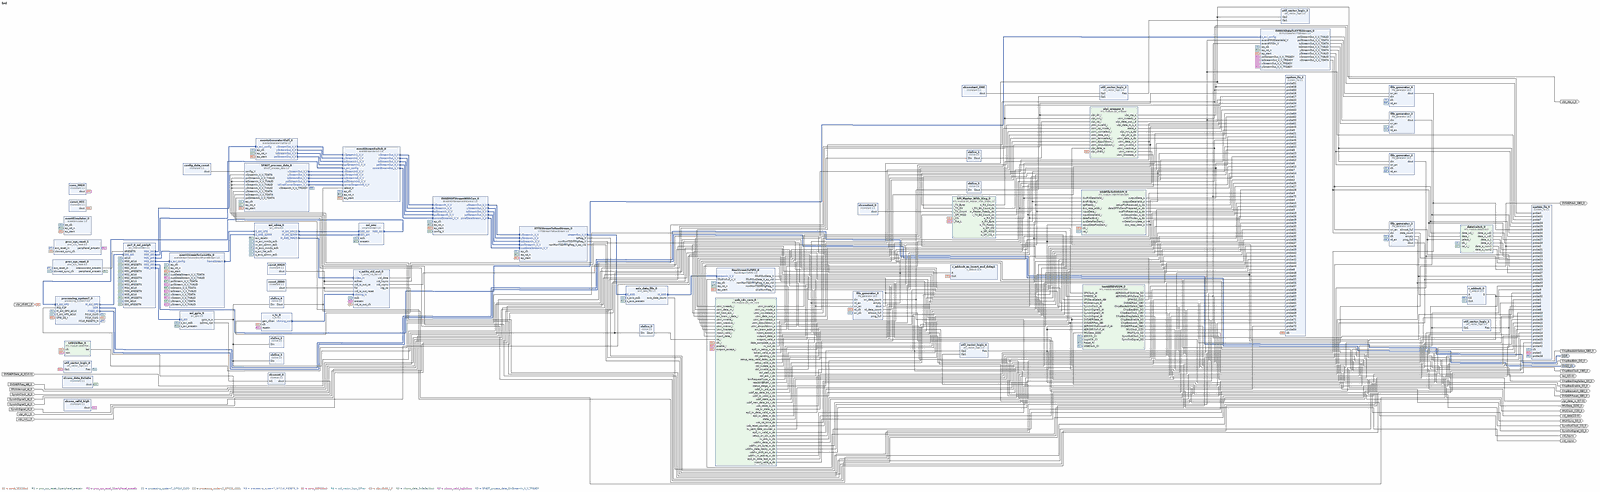
[diagram p0: block diagram of the top level, whole]
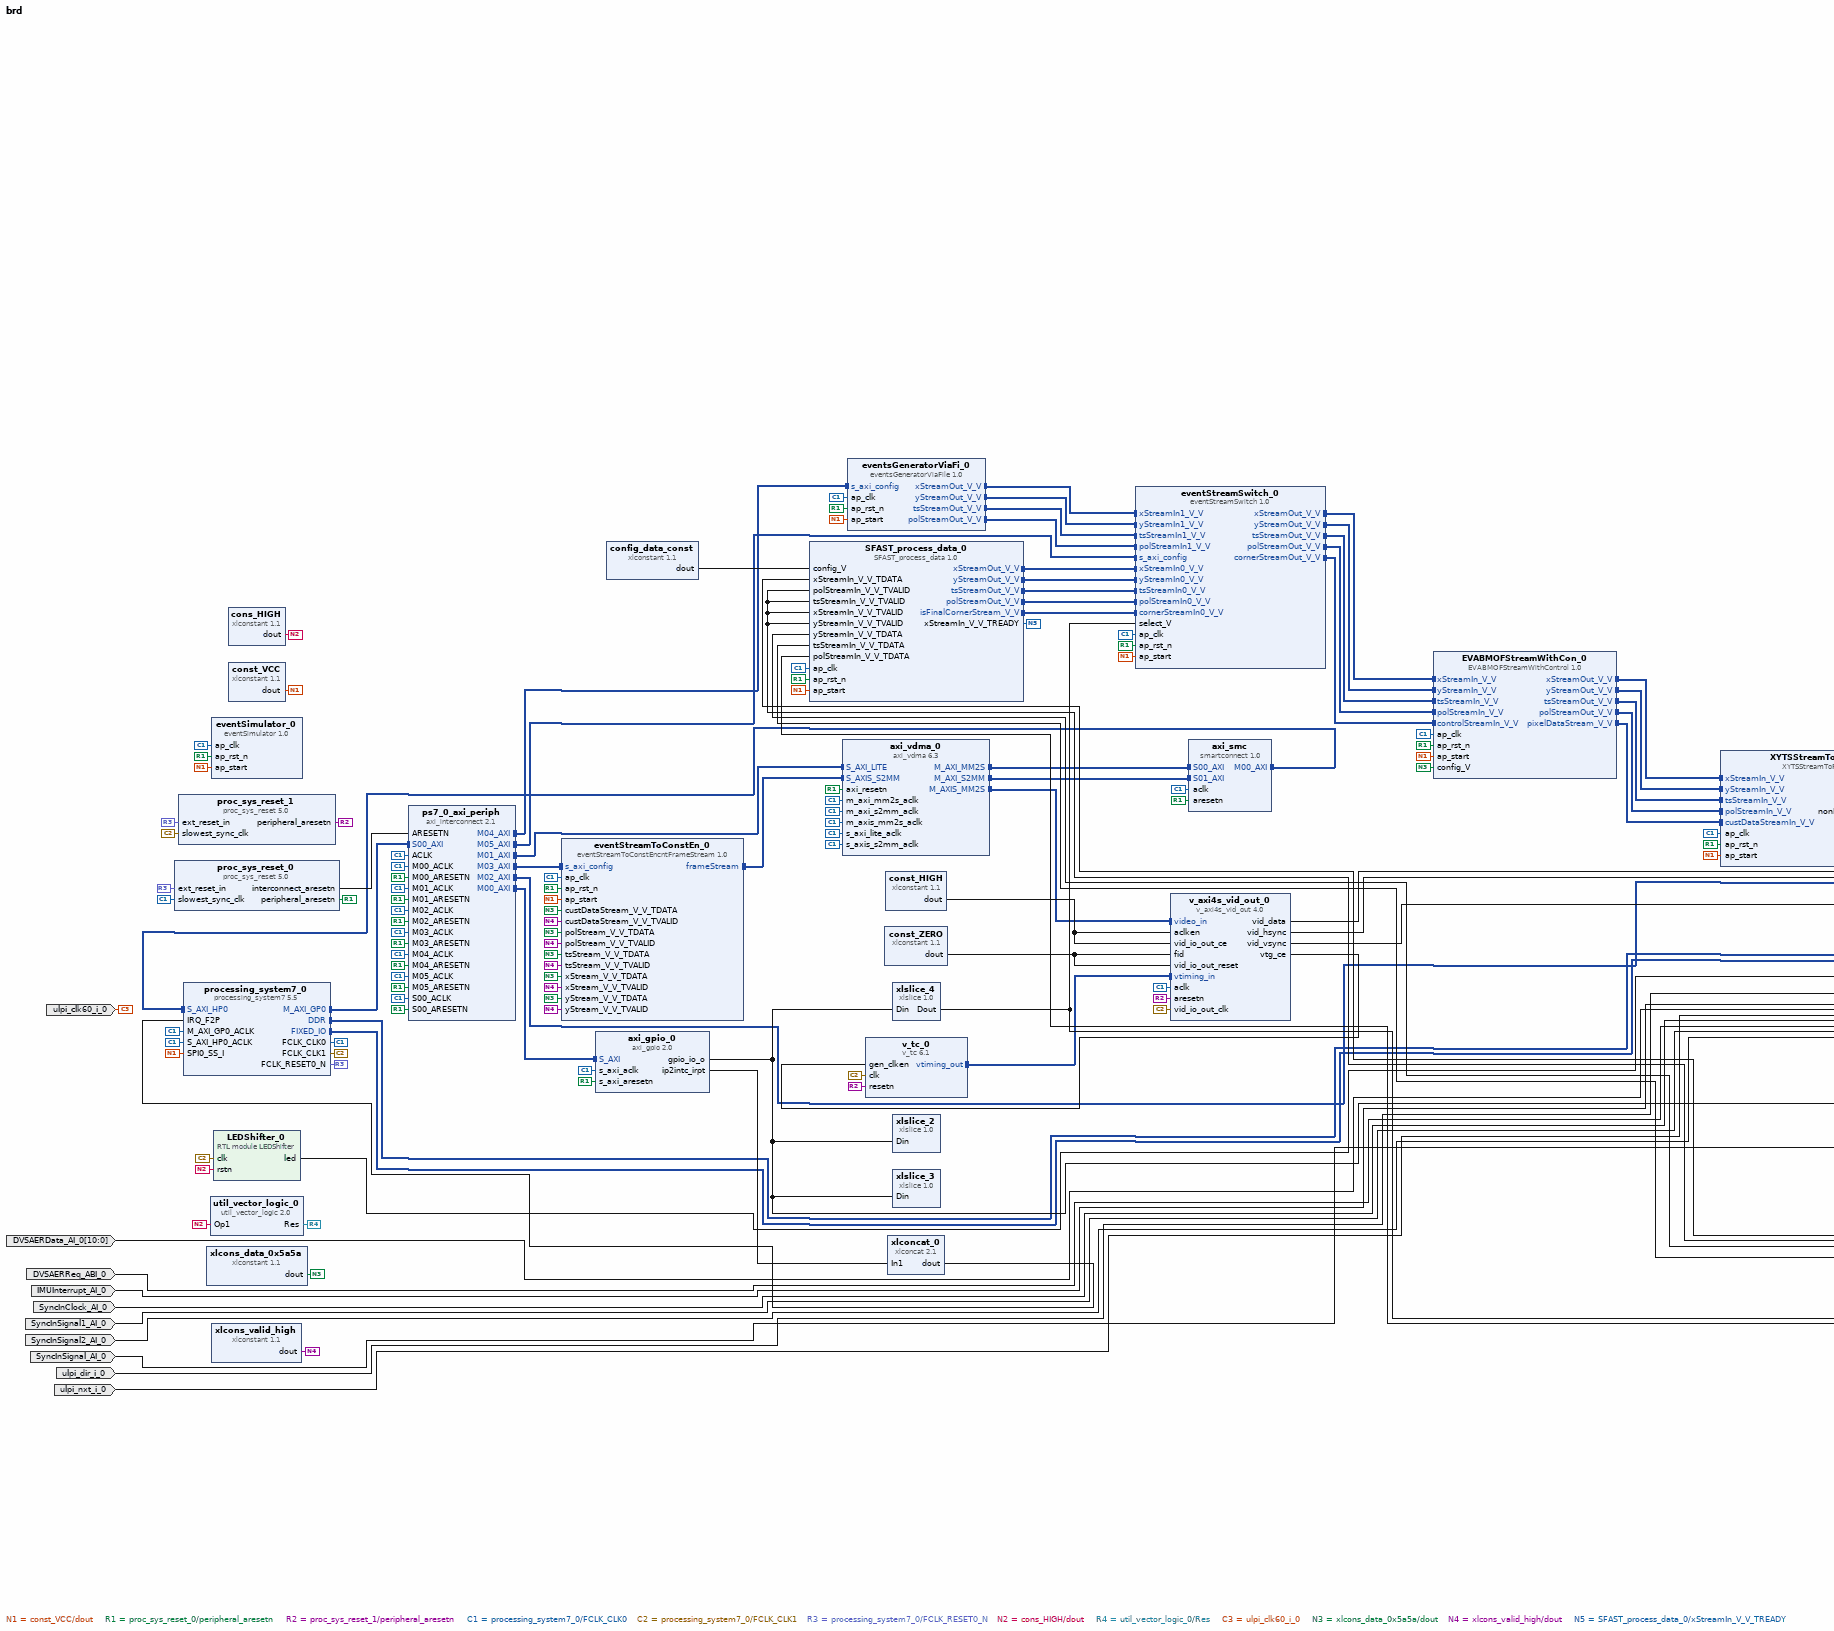
[diagram p1: block diagram of the top level, left part]
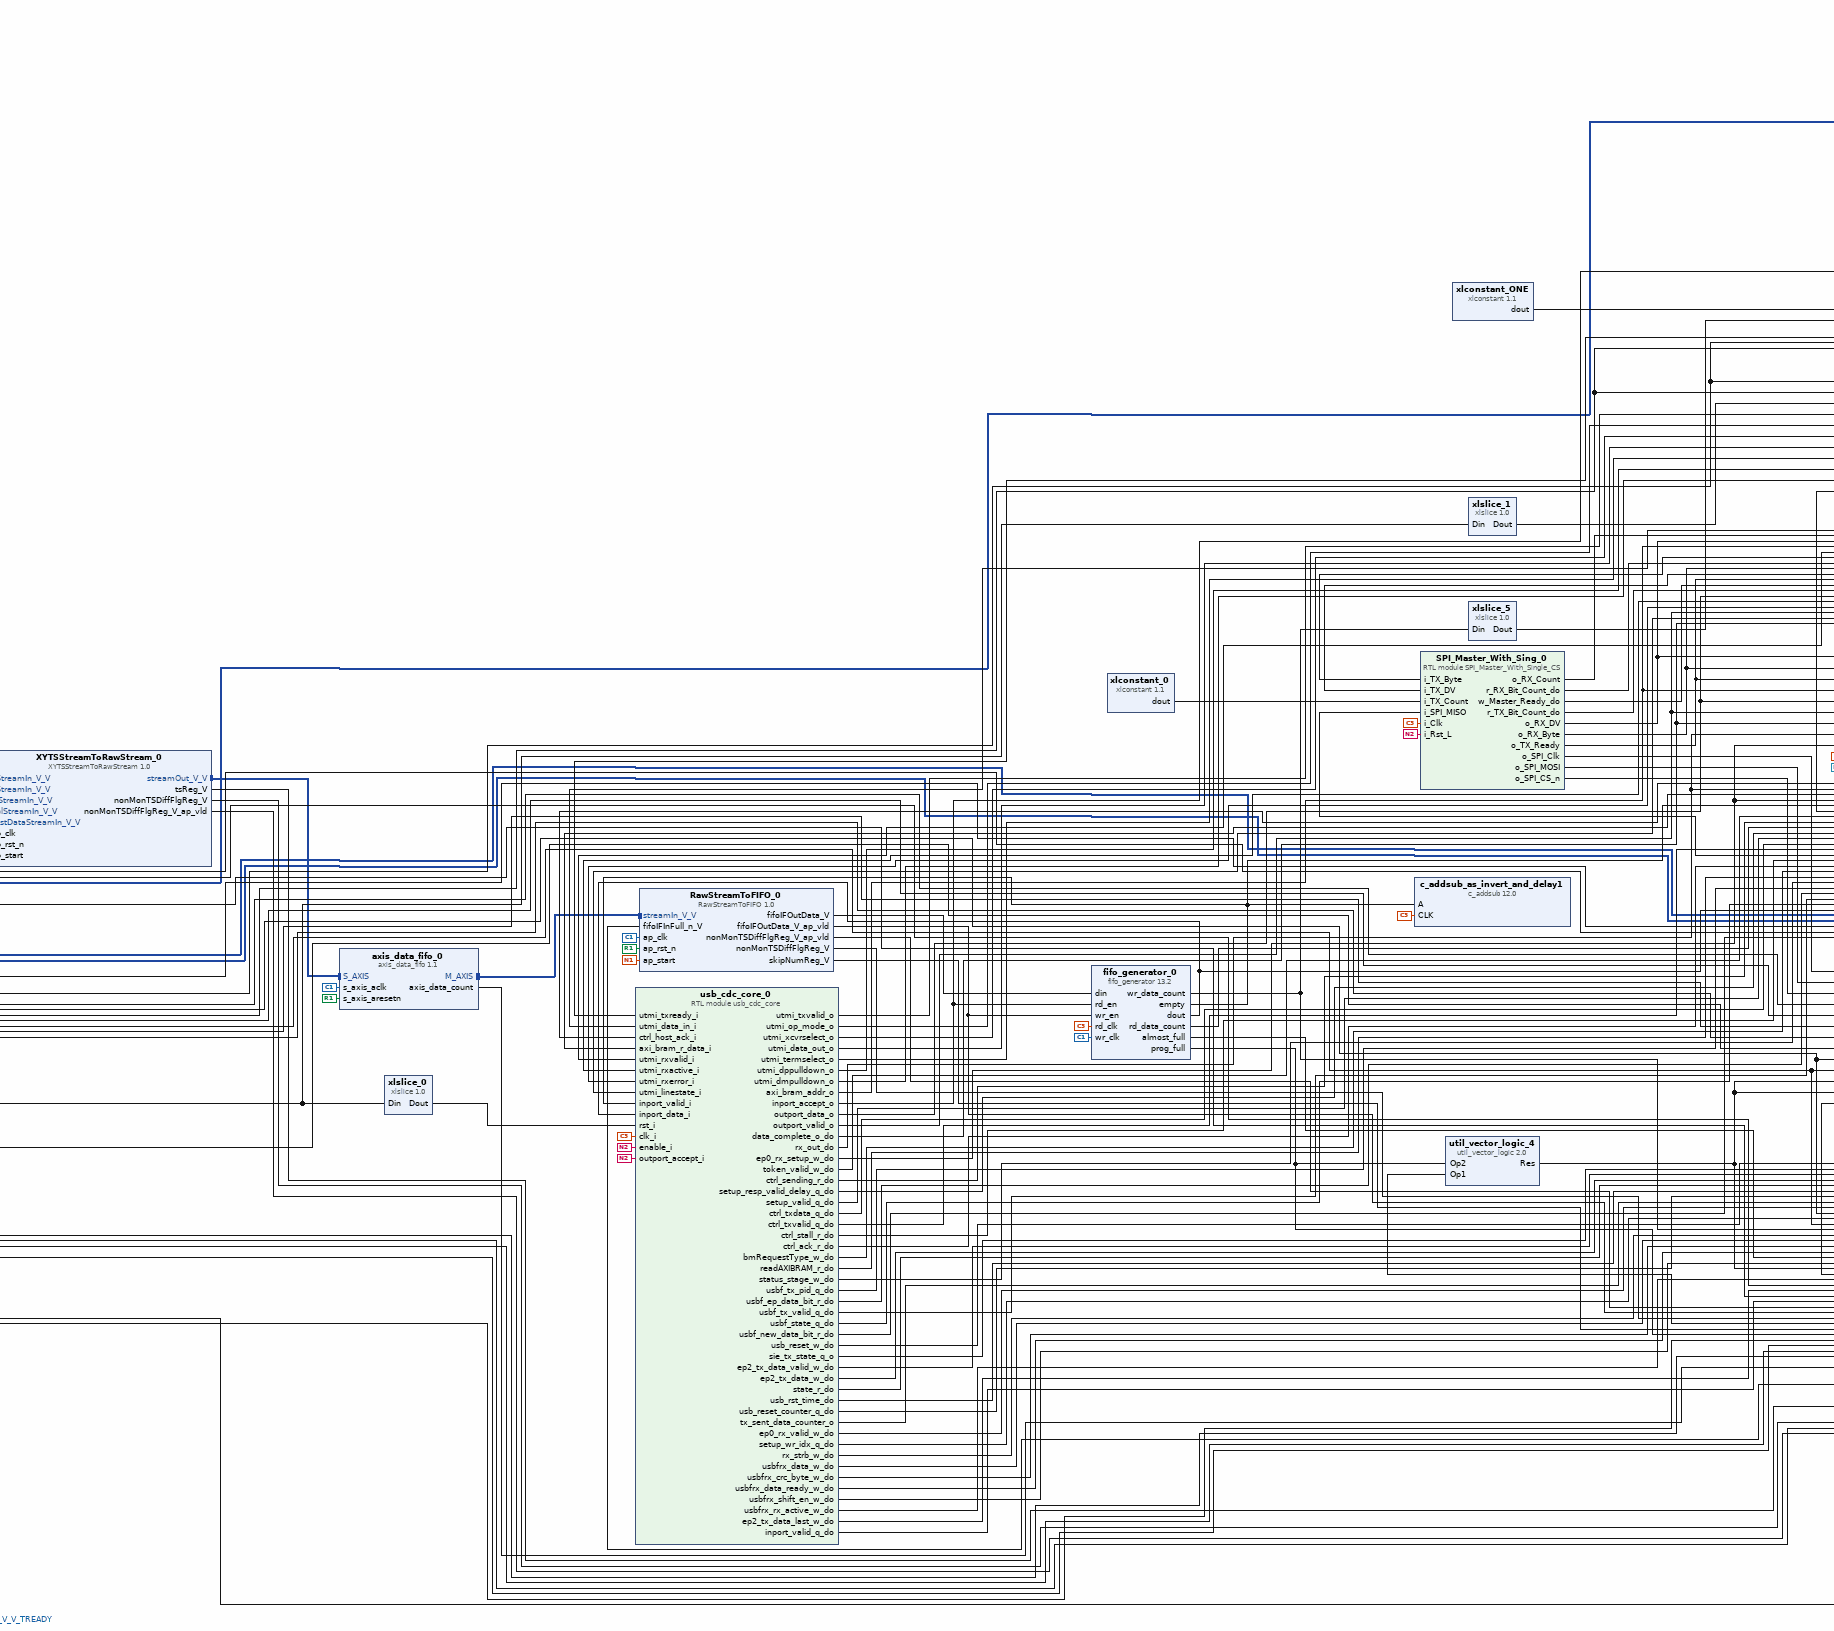
[diagram p2: block diagram of the top level, centre part]
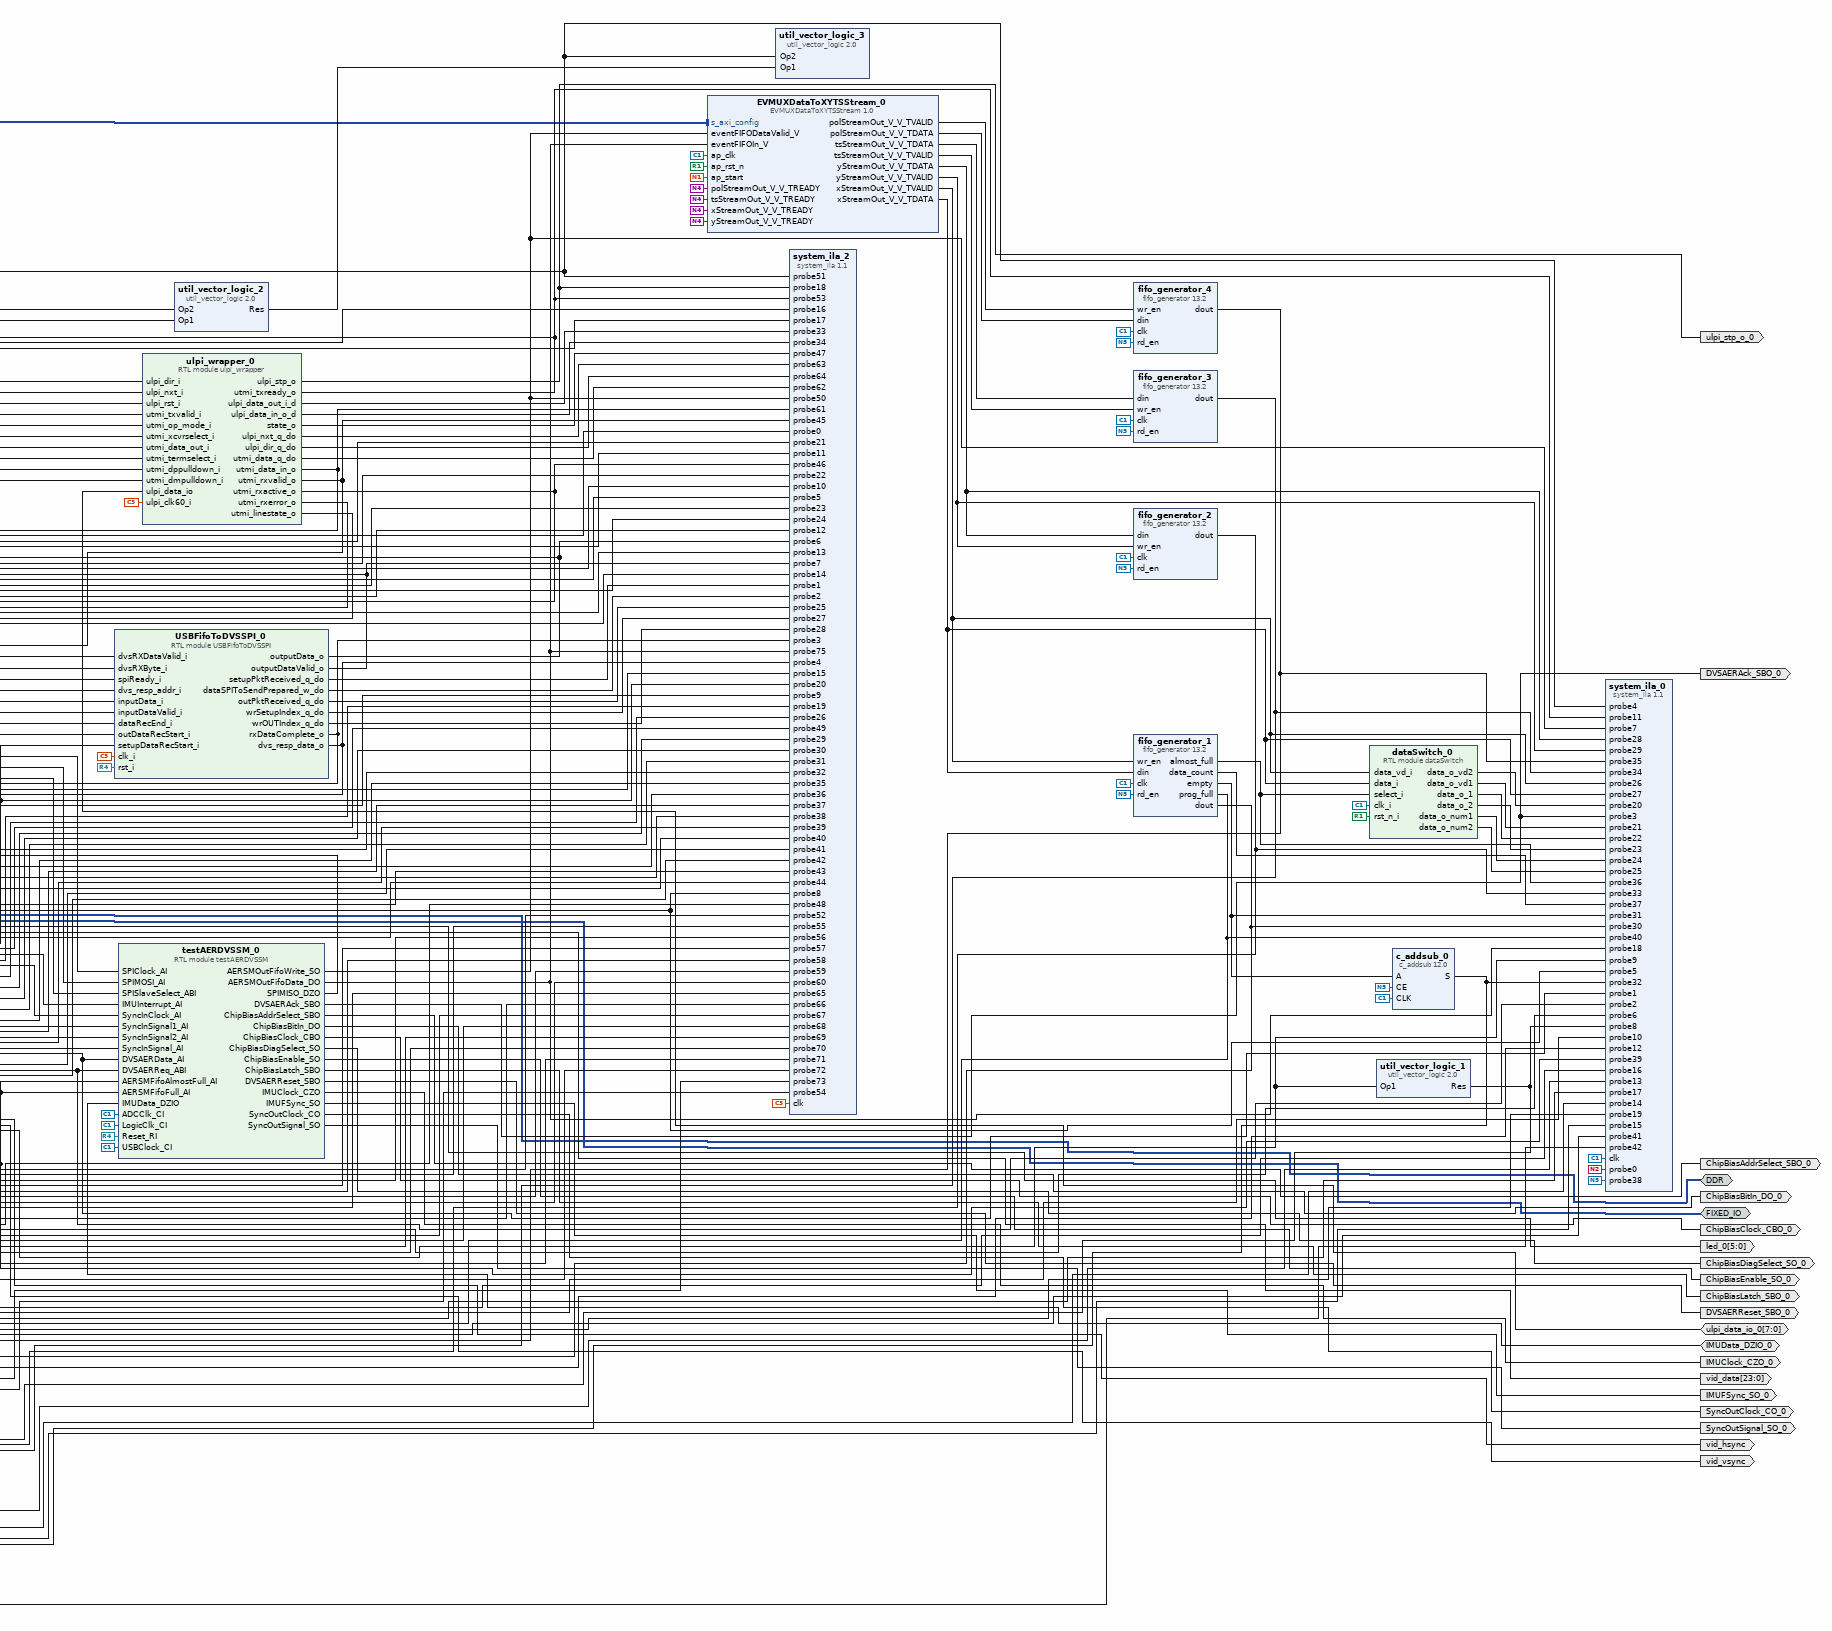
[diagram p3: block diagram of the top level, right part]
# Vivado block design brd, xc7z100ffg900-1, Vivado 2018.1
create_bd_design brd

create_bd_intf_port -mode Master -vlnv xilinx.com:interface:ddrx_rtl:1.0 DDR
create_bd_intf_port -mode Master -vlnv xilinx.com:display_processing_system7:fixedio_rtl:1.0 FIXED_IO
create_bd_port -dir I -from 10 -to 0 DVSAERData_AI_0
create_bd_port -dir I DVSAERReq_ABI_0
create_bd_port -dir I IMUInterrupt_AI_0
create_bd_port -dir O -from 5 -to 0 led_0
create_bd_port -dir IO IMUData_DZIO_0
create_bd_port -dir I SyncInClock_AI_0
create_bd_port -dir I SyncInSignal1_AI_0
create_bd_port -dir I SyncInSignal2_AI_0
create_bd_port -dir I SyncInSignal_AI_0
create_bd_port -dir O ChipBiasAddrSelect_SBO_0
create_bd_port -dir O ChipBiasBitIn_DO_0
create_bd_port -dir O ChipBiasClock_CBO_0
create_bd_port -dir O ChipBiasDiagSelect_SO_0
create_bd_port -dir O ChipBiasEnable_SO_0
create_bd_port -dir O ChipBiasLatch_SBO_0
create_bd_port -dir O DVSAERAck_SBO_0
create_bd_port -dir O DVSAERReset_SBO_0
create_bd_port -dir O IMUClock_CZO_0
create_bd_port -dir O IMUFSync_SO_0
create_bd_port -dir O SyncOutClock_CO_0
create_bd_port -dir O SyncOutSignal_SO_0
create_bd_port -dir O -from 23 -to 0 vid_data
create_bd_port -dir O vid_hsync
create_bd_port -dir O vid_vsync
create_bd_port -dir I ulpi_dir_i_0
create_bd_port -dir I ulpi_nxt_i_0
create_bd_port -dir IO -from 7 -to 0 ulpi_data_io_0
create_bd_port -dir O ulpi_stp_o_0
create_bd_port -dir I ulpi_clk60_i_0

create_bd_cell -type module -reference LEDShifter LEDShifter_0
create_bd_cell -type ip -vlnv xilinx.com:ip:axi_gpio:2.0 axi_gpio_0
set_property -dict [list \
  CONFIG.C_GPIO_WIDTH 32 \
  CONFIG.C_IS_DUAL 0 \
  CONFIG.C_DOUT_DEFAULT 0x00000000 \
  CONFIG.C_INTERRUPT_PRESENT 1 \
  CONFIG.C_ALL_OUTPUTS 1 \
] [get_bd_cells axi_gpio_0]
create_bd_cell -type ip -vlnv xilinx.com:ip:smartconnect:1.0 axi_smc
set_property -dict {CONFIG.NUM_SI 2} [get_bd_cells axi_smc]
create_bd_cell -type ip -vlnv xilinx.com:ip:axi_vdma:6.3 axi_vdma_0
set_property -dict {CONFIG.c_m_axis_mm2s_tdata_width 24} [get_bd_cells axi_vdma_0]
create_bd_cell -type ip -vlnv xilinx.com:ip:xlconstant:1.1 const_HIGH
create_bd_cell -type ip -vlnv xilinx.com:ip:xlconstant:1.1 const_VCC
create_bd_cell -type ip -vlnv xilinx.com:ip:xlconstant:1.1 const_ZERO
set_property -dict {CONFIG.CONST_VAL 0} [get_bd_cells const_ZERO]
create_bd_cell -type ip -vlnv xilinx.com:hls:eventStreamToConstEncntFrameStream:1.0 eventStreamToConstEn_0
create_bd_cell -type ip -vlnv xilinx.com:ip:proc_sys_reset:5.0 proc_sys_reset_0
create_bd_cell -type ip -vlnv xilinx.com:ip:proc_sys_reset:5.0 proc_sys_reset_1
create_bd_cell -type ip -vlnv xilinx.com:ip:processing_system7:5.5 processing_system7_0
set_property -dict [list \
  CONFIG.PCW_FCLK_CLK1_BUF TRUE \
  CONFIG.PCW_FCLK_CLK2_BUF TRUE \
  CONFIG.PCW_FCLK_CLK3_BUF TRUE \
  CONFIG.PCW_UIPARAM_DDR_FREQ_MHZ 533.333333 \
  CONFIG.PCW_CRYSTAL_PERIPHERAL_FREQMHZ 33.33 \
  CONFIG.PCW_APU_PERIPHERAL_FREQMHZ 666.666666 \
  CONFIG.PCW_SDIO_PERIPHERAL_FREQMHZ 100 \
  CONFIG.PCW_UART_PERIPHERAL_FREQMHZ 100 \
  CONFIG.PCW_SPI_PERIPHERAL_FREQMHZ 125 \
  CONFIG.PCW_I2C_PERIPHERAL_FREQMHZ 111.099998 \
  CONFIG.PCW_FPGA0_PERIPHERAL_FREQMHZ 100 \
  CONFIG.PCW_FPGA1_PERIPHERAL_FREQMHZ 40 \
  CONFIG.PCW_FPGA2_PERIPHERAL_FREQMHZ 60 \
  CONFIG.PCW_FPGA3_PERIPHERAL_FREQMHZ 125 \
  CONFIG.PCW_USE_S_AXI_HP0 1 \
  CONFIG.PCW_USE_FABRIC_INTERRUPT 1 \
  CONFIG.PCW_EN_CLK1_PORT 1 \
  CONFIG.PCW_EN_CLK2_PORT 1 \
  CONFIG.PCW_EN_CLK3_PORT 1 \
  CONFIG.PCW_IRQ_F2P_INTR 1 \
  CONFIG.PCW_PERIPHERAL_BOARD_PRESET None \
  CONFIG.PCW_PRESET_BANK1_VOLTAGE {LVCMOS 3.3V} \
  CONFIG.PCW_UIPARAM_DDR_BUS_WIDTH {16 Bit} \
  CONFIG.PCW_UIPARAM_DDR_PARTNO Custom \
  CONFIG.PCW_NAND_PERIPHERAL_ENABLE 1 \
  CONFIG.PCW_NAND_NAND_IO {MIO 0 2.. 14} \
  CONFIG.PCW_ENET0_PERIPHERAL_ENABLE 0 \
  CONFIG.PCW_SD0_PERIPHERAL_ENABLE 1 \
  CONFIG.PCW_SD0_SD0_IO {MIO 16 .. 21} \
  CONFIG.PCW_SD0_GRP_CD_ENABLE 0 \
  CONFIG.PCW_SD0_GRP_WP_ENABLE 0 \
  CONFIG.PCW_UART0_PERIPHERAL_ENABLE 1 \
  CONFIG.PCW_UART0_UART0_IO {MIO 22 .. 23} \
  CONFIG.PCW_UART1_PERIPHERAL_ENABLE 0 \
  CONFIG.PCW_SPI0_PERIPHERAL_ENABLE 1 \
  CONFIG.PCW_SPI0_SPI0_IO EMIO \
  CONFIG.PCW_USB0_PERIPHERAL_ENABLE 1 \
  CONFIG.PCW_USB0_USB0_IO {MIO 28 .. 39} \
  CONFIG.PCW_USB1_PERIPHERAL_ENABLE 1 \
  CONFIG.PCW_USB1_USB1_IO {MIO 40 .. 51} \
  CONFIG.PCW_I2C0_PERIPHERAL_ENABLE 1 \
  CONFIG.PCW_I2C0_I2C0_IO {MIO 26 .. 27} \
  CONFIG.PCW_I2C0_GRP_INT_ENABLE 0 \
  CONFIG.PCW_I2C1_PERIPHERAL_ENABLE 1 \
  CONFIG.PCW_I2C1_I2C1_IO EMIO \
  CONFIG.PCW_GPIO_MIO_GPIO_ENABLE 0 \
  CONFIG.PCW_FPGA_FCLK1_ENABLE 1 \
  CONFIG.PCW_FPGA_FCLK2_ENABLE 1 \
  CONFIG.PCW_FPGA_FCLK3_ENABLE 1 \
] [get_bd_cells processing_system7_0]
# 498 more settings of processing_system7_0 are not shown: defaults, MIO pin electricals, DDR timing, and values the tool derives
create_bd_cell -type ip -vlnv xilinx.com:ip:axi_interconnect:2.1 ps7_0_axi_periph
set_property -dict {CONFIG.NUM_MI 6} [get_bd_cells ps7_0_axi_periph]
create_bd_cell -type ip -vlnv xilinx.com:ip:system_ila:1.1 system_ila_0
set_property -dict [list \
  CONFIG.C_SLOT_3_TYPE 0 \
  CONFIG.C_SLOT_2_TYPE 0 \
  CONFIG.C_SLOT_1_TYPE 0 \
  CONFIG.C_SLOT_0_TYPE 0 \
  CONFIG.C_SLOT_0_APC_EN 0 \
  CONFIG.C_SLOT_1_APC_EN 0 \
  CONFIG.C_SLOT_2_APC_EN 0 \
  CONFIG.C_SLOT_3_APC_EN 0 \
  CONFIG.C_SLOT_4_APC_EN 0 \
  CONFIG.C_SLOT_5_APC_EN 0 \
  CONFIG.C_SLOT_6_APC_EN 0 \
  CONFIG.C_SLOT_0_AXI_DATA_SEL 1 \
  CONFIG.C_SLOT_1_AXI_DATA_SEL 1 \
  CONFIG.C_SLOT_2_AXI_DATA_SEL 1 \
  CONFIG.C_SLOT_3_AXI_DATA_SEL 1 \
  CONFIG.C_SLOT_4_AXI_DATA_SEL 1 \
  CONFIG.C_SLOT_5_AXI_DATA_SEL 1 \
  CONFIG.C_SLOT_6_AXI_DATA_SEL 1 \
  CONFIG.C_SLOT_0_AXI_TRIG_SEL 1 \
  CONFIG.C_SLOT_1_AXI_TRIG_SEL 1 \
  CONFIG.C_SLOT_2_AXI_TRIG_SEL 1 \
  CONFIG.C_SLOT_3_AXI_TRIG_SEL 1 \
  CONFIG.C_SLOT_4_AXI_TRIG_SEL 1 \
  CONFIG.C_SLOT_5_AXI_TRIG_SEL 1 \
  CONFIG.C_SLOT_6_AXI_TRIG_SEL 1 \
  CONFIG.C_PROBE45_TYPE 0 \
  CONFIG.C_PROBE44_TYPE 0 \
  CONFIG.C_PROBE43_TYPE 0 \
  CONFIG.C_PROBE42_TYPE 0 \
  CONFIG.C_PROBE41_TYPE 0 \
  CONFIG.C_PROBE40_TYPE 0 \
  CONFIG.C_PROBE39_TYPE 0 \
  CONFIG.C_PROBE38_TYPE 0 \
  CONFIG.C_PROBE37_TYPE 0 \
  CONFIG.C_PROBE36_TYPE 0 \
  CONFIG.C_PROBE35_TYPE 0 \
  CONFIG.C_PROBE34_TYPE 0 \
  CONFIG.C_PROBE33_TYPE 0 \
  CONFIG.C_PROBE32_TYPE 0 \
  CONFIG.C_PROBE31_TYPE 0 \
  CONFIG.C_PROBE30_TYPE 0 \
  CONFIG.C_PROBE29_TYPE 0 \
  CONFIG.C_PROBE28_TYPE 0 \
  CONFIG.C_PROBE27_TYPE 0 \
  CONFIG.C_PROBE26_TYPE 0 \
  CONFIG.C_PROBE25_TYPE 0 \
  CONFIG.C_PROBE24_TYPE 0 \
  CONFIG.C_PROBE23_TYPE 0 \
  CONFIG.C_PROBE22_TYPE 0 \
  CONFIG.C_PROBE21_TYPE 0 \
  CONFIG.C_PROBE20_TYPE 0 \
  CONFIG.C_PROBE19_TYPE 0 \
  CONFIG.C_PROBE18_TYPE 0 \
  CONFIG.C_PROBE17_TYPE 0 \
  CONFIG.C_PROBE16_TYPE 0 \
  CONFIG.C_PROBE15_TYPE 0 \
  CONFIG.C_PROBE14_TYPE 0 \
  CONFIG.C_PROBE13_TYPE 0 \
  CONFIG.C_PROBE12_TYPE 0 \
  CONFIG.C_PROBE11_TYPE 0 \
  CONFIG.C_PROBE10_TYPE 0 \
  CONFIG.C_PROBE9_TYPE 0 \
  CONFIG.C_PROBE8_TYPE 0 \
  CONFIG.C_PROBE7_TYPE 0 \
  CONFIG.C_PROBE6_TYPE 0 \
  CONFIG.C_PROBE5_TYPE 0 \
  CONFIG.C_PROBE4_TYPE 0 \
  CONFIG.C_PROBE3_TYPE 0 \
  CONFIG.C_PROBE2_TYPE 0 \
  CONFIG.C_PROBE1_TYPE 0 \
  CONFIG.C_PROBE0_TYPE 0 \
  CONFIG.C_DATA_DEPTH 8192 \
  CONFIG.C_NUM_OF_PROBES 43 \
  CONFIG.C_NUM_MONITOR_SLOTS 1 \
  CONFIG.C_SLOT_0_INTF_TYPE xilinx.com:interface:axis_rtl:1.0 \
  CONFIG.C_SLOT_1_INTF_TYPE xilinx.com:interface:axis_rtl:1.0 \
  CONFIG.C_SLOT_2_INTF_TYPE xilinx.com:interface:axis_rtl:1.0 \
  CONFIG.C_SLOT_3_INTF_TYPE xilinx.com:interface:axis_rtl:1.0 \
  CONFIG.C_SLOT_4_INTF_TYPE xilinx.com:interface:axis_rtl:1.0 \
  CONFIG.C_SLOT_5_INTF_TYPE xilinx.com:interface:axis_rtl:1.0 \
  CONFIG.C_SLOT_6_INTF_TYPE xilinx.com:interface:axis_rtl:1.0 \
  CONFIG.C_MON_TYPE NATIVE \
] [get_bd_cells system_ila_0]
create_bd_cell -type ip -vlnv xilinx.com:ip:system_ila:1.1 system_ila_2
set_property -dict [list \
  CONFIG.C_SLOT_0_APC_EN 0 \
  CONFIG.C_SLOT_1_APC_EN 0 \
  CONFIG.C_SLOT_0_AXI_DATA_SEL 1 \
  CONFIG.C_SLOT_1_AXI_DATA_SEL 1 \
  CONFIG.C_SLOT_0_AXI_TRIG_SEL 1 \
  CONFIG.C_SLOT_1_AXI_TRIG_SEL 1 \
  CONFIG.C_PROBE80_TYPE 0 \
  CONFIG.C_PROBE79_TYPE 0 \
  CONFIG.C_PROBE78_TYPE 0 \
  CONFIG.C_PROBE77_TYPE 0 \
  CONFIG.C_PROBE76_TYPE 0 \
  CONFIG.C_PROBE75_TYPE 0 \
  CONFIG.C_PROBE74_TYPE 0 \
  CONFIG.C_PROBE73_TYPE 0 \
  CONFIG.C_PROBE72_TYPE 0 \
  CONFIG.C_PROBE71_TYPE 0 \
  CONFIG.C_PROBE70_TYPE 0 \
  CONFIG.C_PROBE69_TYPE 0 \
  CONFIG.C_PROBE68_TYPE 0 \
  CONFIG.C_PROBE67_TYPE 0 \
  CONFIG.C_PROBE66_TYPE 0 \
  CONFIG.C_PROBE65_TYPE 0 \
  CONFIG.C_PROBE64_TYPE 0 \
  CONFIG.C_PROBE63_TYPE 0 \
  CONFIG.C_PROBE62_TYPE 0 \
  CONFIG.C_PROBE61_TYPE 0 \
  CONFIG.C_PROBE60_TYPE 0 \
  CONFIG.C_PROBE59_TYPE 0 \
  CONFIG.C_PROBE58_TYPE 0 \
  CONFIG.C_PROBE57_TYPE 0 \
  CONFIG.C_PROBE56_TYPE 0 \
  CONFIG.C_PROBE55_TYPE 0 \
  CONFIG.C_PROBE54_TYPE 0 \
  CONFIG.C_PROBE53_TYPE 0 \
  CONFIG.C_PROBE52_TYPE 0 \
  CONFIG.C_PROBE51_TYPE 0 \
  CONFIG.C_PROBE50_TYPE 0 \
  CONFIG.C_PROBE49_TYPE 0 \
  CONFIG.C_PROBE48_TYPE 0 \
  CONFIG.C_PROBE47_TYPE 0 \
  CONFIG.C_PROBE46_TYPE 0 \
  CONFIG.C_PROBE45_TYPE 0 \
  CONFIG.C_PROBE44_TYPE 0 \
  CONFIG.C_PROBE43_TYPE 0 \
  CONFIG.C_PROBE42_TYPE 0 \
  CONFIG.C_PROBE41_TYPE 0 \
  CONFIG.C_PROBE40_TYPE 0 \
  CONFIG.C_PROBE39_TYPE 0 \
  CONFIG.C_PROBE38_TYPE 0 \
  CONFIG.C_PROBE37_TYPE 0 \
  CONFIG.C_PROBE36_TYPE 0 \
  CONFIG.C_PROBE35_TYPE 0 \
  CONFIG.C_PROBE34_TYPE 0 \
  CONFIG.C_PROBE33_TYPE 0 \
  CONFIG.C_PROBE32_TYPE 0 \
  CONFIG.C_PROBE31_TYPE 0 \
  CONFIG.C_PROBE30_TYPE 0 \
  CONFIG.C_PROBE29_TYPE 0 \
  CONFIG.C_PROBE28_TYPE 0 \
  CONFIG.C_PROBE27_TYPE 0 \
  CONFIG.C_PROBE26_TYPE 0 \
  CONFIG.C_PROBE25_TYPE 0 \
  CONFIG.C_PROBE24_TYPE 0 \
  CONFIG.C_PROBE23_TYPE 0 \
  CONFIG.C_PROBE22_TYPE 0 \
  CONFIG.C_PROBE21_TYPE 0 \
  CONFIG.C_PROBE20_TYPE 0 \
  CONFIG.C_PROBE19_TYPE 0 \
  CONFIG.C_PROBE18_TYPE 0 \
  CONFIG.C_PROBE17_TYPE 0 \
  CONFIG.C_PROBE16_TYPE 0 \
  CONFIG.C_PROBE15_TYPE 0 \
  CONFIG.C_PROBE14_TYPE 0 \
  CONFIG.C_PROBE13_TYPE 0 \
  CONFIG.C_PROBE12_TYPE 0 \
  CONFIG.C_PROBE11_TYPE 0 \
  CONFIG.C_PROBE10_TYPE 0 \
  CONFIG.C_PROBE9_TYPE 0 \
  CONFIG.C_PROBE8_TYPE 0 \
  CONFIG.C_PROBE7_TYPE 0 \
  CONFIG.C_PROBE6_TYPE 0 \
  CONFIG.C_PROBE5_TYPE 0 \
  CONFIG.C_PROBE4_TYPE 0 \
  CONFIG.C_PROBE3_TYPE 0 \
  CONFIG.C_PROBE2_TYPE 0 \
  CONFIG.C_PROBE1_TYPE 0 \
  CONFIG.C_PROBE0_TYPE 0 \
  CONFIG.C_DATA_DEPTH 1024 \
  CONFIG.C_NUM_OF_PROBES 76 \
  CONFIG.C_NUM_MONITOR_SLOTS 1 \
  CONFIG.C_SLOT_0_INTF_TYPE xilinx.com:interface:axis_rtl:1.0 \
  CONFIG.C_SLOT_1_INTF_TYPE xilinx.com:interface:axis_rtl:1.0 \
  CONFIG.C_MON_TYPE NATIVE \
] [get_bd_cells system_ila_2]
create_bd_cell -type ip -vlnv xilinx.com:ip:util_vector_logic:2.0 util_vector_logic_0
set_property -dict {CONFIG.C_SIZE 1 CONFIG.C_OPERATION not} [get_bd_cells util_vector_logic_0]
create_bd_cell -type ip -vlnv xilinx.com:ip:v_axi4s_vid_out:4.0 v_axi4s_vid_out_0
set_property -dict {CONFIG.C_HAS_ASYNC_CLK 1} [get_bd_cells v_axi4s_vid_out_0]
create_bd_cell -type ip -vlnv xilinx.com:ip:v_tc:6.1 v_tc_0
set_property -dict {CONFIG.HAS_AXI4_LITE false CONFIG.VIDEO_MODE 800x600p CONFIG.enable_detection false} [get_bd_cells v_tc_0]
create_bd_cell -type ip -vlnv xilinx.com:ip:xlconcat:2.1 xlconcat_0
create_bd_cell -type ip -vlnv xilinx.com:ip:xlconstant:1.1 xlconstant_0
set_property -dict {CONFIG.CONST_WIDTH 3 CONFIG.CONST_VAL 1} [get_bd_cells xlconstant_0]
create_bd_cell -type ip -vlnv xilinx.com:ip:xlconstant:1.1 cons_HIGH
set_property -dict {CONFIG.CONST_WIDTH 1 CONFIG.CONST_VAL 1} [get_bd_cells cons_HIGH]
create_bd_cell -type ip -vlnv xilinx.com:ip:xlslice:1.0 xlslice_0
create_bd_cell -type ip -vlnv xilinx.com:ip:xlslice:1.0 xlslice_1
set_property -dict {CONFIG.DIN_TO 1 CONFIG.DIN_FROM 1 CONFIG.DOUT_WIDTH 1} [get_bd_cells xlslice_1]
create_bd_cell -type ip -vlnv xilinx.com:ip:xlslice:1.0 xlslice_2
set_property -dict {CONFIG.DIN_TO 2 CONFIG.DIN_FROM 2 CONFIG.DOUT_WIDTH 1} [get_bd_cells xlslice_2]
create_bd_cell -type ip -vlnv xilinx.com:ip:xlslice:1.0 xlslice_3
set_property -dict {CONFIG.DIN_TO 3 CONFIG.DIN_FROM 3 CONFIG.DOUT_WIDTH 1} [get_bd_cells xlslice_3]
create_bd_cell -type ip -vlnv xilinx.com:ip:xlslice:1.0 xlslice_4
set_property -dict {CONFIG.DIN_TO 16 CONFIG.DIN_FROM 31 CONFIG.DOUT_WIDTH 16} [get_bd_cells xlslice_4]
create_bd_cell -type ip -vlnv xilinx.com:ip:fifo_generator:13.2 fifo_generator_0
set_property -dict [list \
  CONFIG.Fifo_Implementation Independent_Clocks_Block_RAM \
  CONFIG.Input_Data_Width 16 \
  CONFIG.Input_Depth 16384 \
  CONFIG.Output_Data_Width 8 \
  CONFIG.Use_Embedded_Registers false \
  CONFIG.Reset_Pin false \
  CONFIG.Almost_Full_Flag true \
  CONFIG.Write_Data_Count true \
  CONFIG.Write_Data_Count_Width 14 \
  CONFIG.Read_Data_Count true \
  CONFIG.Read_Data_Count_Width 15 \
  CONFIG.Programmable_Full_Type Single_Programmable_Full_Threshold_Constant \
  CONFIG.Full_Threshold_Assert_Value 10001 \
  CONFIG.Programmable_Empty_Type No_Programmable_Empty_Threshold \
] [get_bd_cells fifo_generator_0]
create_bd_cell -type ip -vlnv xilinx.com:ip:util_vector_logic:2.0 util_vector_logic_2
set_property -dict {CONFIG.C_SIZE 1 CONFIG.C_OPERATION and} [get_bd_cells util_vector_logic_2]
create_bd_cell -type ip -vlnv xilinx.com:ip:xlslice:1.0 xlslice_5
set_property -dict {CONFIG.DIN_TO 2 CONFIG.DIN_FROM 2 CONFIG.DIN_WIDTH 13 CONFIG.DOUT_WIDTH 1} [get_bd_cells xlslice_5]
create_bd_cell -type ip -vlnv xilinx.com:ip:xlconstant:1.1 xlconstant_ONE
create_bd_cell -type ip -vlnv xilinx.com:ip:util_vector_logic:2.0 util_vector_logic_3
set_property -dict {CONFIG.C_SIZE 1} [get_bd_cells util_vector_logic_3]
create_bd_cell -type module -reference USBFifoToDVSSPI USBFifoToDVSSPI_0
create_bd_cell -type module -reference SPI_Master_With_Single_CS SPI_Master_With_Sing_0
set_property -dict [list \
  CONFIG.CLKS_PER_HALF_BIT 10 \
  CONFIG.MAX_BYTES_PER_CS 6 \
  CONFIG.CS_INACTIVE_CLKS 1 \
] [get_bd_cells SPI_Master_With_Sing_0]
create_bd_cell -type module -reference ulpi_wrapper ulpi_wrapper_0
create_bd_cell -type ip -vlnv xilinx.com:ip:c_addsub:12.0 c_addsub_as_invert_and_delay1
set_property -dict [list \
  CONFIG.Implementation Fabric \
  CONFIG.A_Type Unsigned \
  CONFIG.B_Type Unsigned \
  CONFIG.A_Width 1 \
  CONFIG.B_Width 1 \
  CONFIG.Out_Width 1 \
  CONFIG.Latency 1 \
  CONFIG.B_Constant true \
  CONFIG.B_Value 1 \
  CONFIG.CE false \
] [get_bd_cells c_addsub_as_invert_and_delay1]
create_bd_cell -type ip -vlnv xilinx.com:ip:util_vector_logic:2.0 util_vector_logic_1
set_property -dict {CONFIG.C_SIZE 1 CONFIG.C_OPERATION not} [get_bd_cells util_vector_logic_1]
create_bd_cell -type module -reference usb_cdc_core usb_cdc_core_0
create_bd_cell -type ip -vlnv xilinx.com:ip:xlconstant:1.1 xlcons_valid_high
create_bd_cell -type ip -vlnv xilinx.com:ip:xlconstant:1.1 xlcons_data_0x5a5a
set_property -dict {CONFIG.CONST_WIDTH 16 CONFIG.CONST_VAL 0x5a5a} [get_bd_cells xlcons_data_0x5a5a]
create_bd_cell -type ip -vlnv xilinx.com:ip:axis_data_fifo:1.1 axis_data_fifo_0
set_property -dict {CONFIG.FIFO_DEPTH 16} [get_bd_cells axis_data_fifo_0]
create_bd_cell -type ip -vlnv xilinx.com:ip:fifo_generator:13.2 fifo_generator_1
set_property -dict [list \
  CONFIG.Input_Data_Width 16 \
  CONFIG.Input_Depth 1024 \
  CONFIG.Output_Data_Width 16 \
  CONFIG.Reset_Pin false \
  CONFIG.Almost_Full_Flag true \
  CONFIG.Almost_Empty_Flag false \
  CONFIG.Data_Count true \
  CONFIG.Data_Count_Width 10 \
  CONFIG.Programmable_Full_Type Single_Programmable_Full_Threshold_Constant \
  CONFIG.Full_Threshold_Assert_Value 1001 \
] [get_bd_cells fifo_generator_1]
create_bd_cell -type ip -vlnv xilinx.com:ip:fifo_generator:13.2 fifo_generator_2
set_property -dict [list \
  CONFIG.Input_Data_Width 16 \
  CONFIG.Input_Depth 1024 \
  CONFIG.Output_Data_Width 16 \
  CONFIG.Reset_Pin false \
  CONFIG.Almost_Full_Flag true \
  CONFIG.Almost_Empty_Flag false \
] [get_bd_cells fifo_generator_2]
create_bd_cell -type ip -vlnv xilinx.com:ip:fifo_generator:13.2 fifo_generator_3
set_property -dict [list \
  CONFIG.Input_Data_Width 64 \
  CONFIG.Input_Depth 1024 \
  CONFIG.Output_Data_Width 64 \
  CONFIG.Reset_Pin false \
  CONFIG.Almost_Full_Flag true \
  CONFIG.Almost_Empty_Flag false \
] [get_bd_cells fifo_generator_3]
create_bd_cell -type ip -vlnv xilinx.com:ip:fifo_generator:13.2 fifo_generator_4
set_property -dict [list \
  CONFIG.Input_Data_Width 8 \
  CONFIG.Input_Depth 1024 \
  CONFIG.Output_Data_Width 8 \
  CONFIG.Reset_Pin false \
  CONFIG.Almost_Full_Flag true \
  CONFIG.Almost_Empty_Flag false \
] [get_bd_cells fifo_generator_4]
create_bd_cell -type ip -vlnv xilinx.com:ip:c_addsub:12.0 c_addsub_0
set_property -dict [list \
  CONFIG.A_Type Unsigned \
  CONFIG.B_Type Unsigned \
  CONFIG.A_Width 1 \
  CONFIG.B_Width 1 \
  CONFIG.Out_Width 1 \
  CONFIG.Latency 1 \
  CONFIG.B_Constant true \
  CONFIG.B_Value 1 \
  CONFIG.CE true \
] [get_bd_cells c_addsub_0]
create_bd_cell -type module -reference dataSwitch dataSwitch_0
create_bd_cell -type ip -vlnv xilinx.com:ip:util_vector_logic:2.0 util_vector_logic_4
set_property -dict {CONFIG.C_SIZE 1 CONFIG.C_OPERATION or} [get_bd_cells util_vector_logic_4]
create_bd_cell -type module -reference testAERDVSSM testAERDVSSM_0
create_bd_cell -type ip -vlnv xilinx.com:hls:RawStreamToFIFO:1.0 RawStreamToFIFO_0
create_bd_cell -type ip -vlnv xilinx.com:hls:eventSimulator:1.0 eventSimulator_0
create_bd_cell -type ip -vlnv xilinx.com:hls:eventsGeneratorViaFile:1.0 eventsGeneratorViaFi_0
create_bd_cell -type ip -vlnv xilinx.com:hls:EVMUXDataToXYTSStream:1.0 EVMUXDataToXYTSStream_0
create_bd_cell -type ip -vlnv xilinx.com:hls:XYTSStreamToRawStream:1.0 XYTSStreamToRawStream_0
create_bd_cell -type ip -vlnv xilinx.com:hls:eventStreamSwitch:1.0 eventStreamSwitch_0
create_bd_cell -type ip -vlnv xilinx.com:hls:SFAST_process_data:1.0 SFAST_process_data_0
create_bd_cell -type ip -vlnv xilinx.com:ip:xlconstant:1.1 config_data_const
set_property -dict {CONFIG.CONST_WIDTH 32 CONFIG.CONST_VAL 0} [get_bd_cells config_data_const]
create_bd_cell -type ip -vlnv xilinx.com:hls:EVABMOFStreamWithControl:1.0 EVABMOFStreamWithCon_0

# ---- connections ----

connect_bd_intf_net [get_bd_intf_pins v_axi4s_vid_out_0/vtiming_in] [get_bd_intf_pins v_tc_0/vtiming_out]
connect_bd_intf_net [get_bd_intf_pins axi_vdma_0/S_AXIS_S2MM] [get_bd_intf_pins eventStreamToConstEn_0/frameStream]
connect_bd_intf_net [get_bd_intf_pins v_axi4s_vid_out_0/video_in] [get_bd_intf_pins axi_vdma_0/M_AXIS_MM2S]
connect_bd_intf_net [get_bd_intf_pins axi_vdma_0/M_AXI_MM2S] [get_bd_intf_pins axi_smc/S00_AXI]
connect_bd_intf_net [get_bd_intf_pins axi_smc/M00_AXI] [get_bd_intf_pins processing_system7_0/S_AXI_HP0]
connect_bd_intf_net [get_bd_intf_pins axi_vdma_0/M_AXI_S2MM] [get_bd_intf_pins axi_smc/S01_AXI]
connect_bd_intf_net [get_bd_intf_pins processing_system7_0/M_AXI_GP0] [get_bd_intf_pins ps7_0_axi_periph/S00_AXI]
connect_bd_intf_net [get_bd_intf_pins ps7_0_axi_periph/M00_AXI] [get_bd_intf_pins axi_gpio_0/S_AXI]
connect_bd_intf_net [get_bd_intf_pins ps7_0_axi_periph/M01_AXI] [get_bd_intf_pins axi_vdma_0/S_AXI_LITE]
connect_bd_intf_net [get_bd_intf_pins ps7_0_axi_periph/M02_AXI] [get_bd_intf_pins EVMUXDataToXYTSStream_0/s_axi_config]
connect_bd_intf_net [get_bd_intf_pins XYTSStreamToRawStream_0/streamOut_V_V] [get_bd_intf_pins axis_data_fifo_0/S_AXIS]
connect_bd_intf_net [get_bd_intf_pins axis_data_fifo_0/M_AXIS] [get_bd_intf_pins RawStreamToFIFO_0/streamIn_V_V]
connect_bd_intf_net [get_bd_intf_pins ps7_0_axi_periph/M03_AXI] [get_bd_intf_pins eventStreamToConstEn_0/s_axi_config]
connect_bd_intf_net [get_bd_intf_pins ps7_0_axi_periph/M04_AXI] [get_bd_intf_pins eventsGeneratorViaFi_0/s_axi_config]
connect_bd_intf_net [get_bd_intf_pins eventsGeneratorViaFi_0/xStreamOut_V_V] [get_bd_intf_pins eventStreamSwitch_0/xStreamIn1_V_V]
connect_bd_intf_net [get_bd_intf_pins eventsGeneratorViaFi_0/yStreamOut_V_V] [get_bd_intf_pins eventStreamSwitch_0/yStreamIn1_V_V]
connect_bd_intf_net [get_bd_intf_pins eventsGeneratorViaFi_0/tsStreamOut_V_V] [get_bd_intf_pins eventStreamSwitch_0/tsStreamIn1_V_V]
connect_bd_intf_net [get_bd_intf_pins eventsGeneratorViaFi_0/polStreamOut_V_V] [get_bd_intf_pins eventStreamSwitch_0/polStreamIn1_V_V]
connect_bd_intf_net [get_bd_intf_pins EVABMOFStreamWithCon_0/xStreamOut_V_V] [get_bd_intf_pins XYTSStreamToRawStream_0/xStreamIn_V_V]
connect_bd_intf_net [get_bd_intf_pins EVABMOFStreamWithCon_0/yStreamOut_V_V] [get_bd_intf_pins XYTSStreamToRawStream_0/yStreamIn_V_V]
connect_bd_intf_net [get_bd_intf_pins EVABMOFStreamWithCon_0/tsStreamOut_V_V] [get_bd_intf_pins XYTSStreamToRawStream_0/tsStreamIn_V_V]
connect_bd_intf_net [get_bd_intf_pins EVABMOFStreamWithCon_0/polStreamOut_V_V] [get_bd_intf_pins XYTSStreamToRawStream_0/polStreamIn_V_V]
connect_bd_intf_net [get_bd_intf_pins EVABMOFStreamWithCon_0/pixelDataStream_V_V] [get_bd_intf_pins XYTSStreamToRawStream_0/custDataStreamIn_V_V]
connect_bd_intf_net [get_bd_intf_pins eventStreamSwitch_0/xStreamOut_V_V] [get_bd_intf_pins EVABMOFStreamWithCon_0/xStreamIn_V_V]
connect_bd_intf_net [get_bd_intf_pins eventStreamSwitch_0/yStreamOut_V_V] [get_bd_intf_pins EVABMOFStreamWithCon_0/yStreamIn_V_V]
connect_bd_intf_net [get_bd_intf_pins eventStreamSwitch_0/tsStreamOut_V_V] [get_bd_intf_pins EVABMOFStreamWithCon_0/tsStreamIn_V_V]
connect_bd_intf_net [get_bd_intf_pins eventStreamSwitch_0/polStreamOut_V_V] [get_bd_intf_pins EVABMOFStreamWithCon_0/polStreamIn_V_V]
connect_bd_intf_net [get_bd_intf_pins eventStreamSwitch_0/cornerStreamOut_V_V] [get_bd_intf_pins EVABMOFStreamWithCon_0/controlStreamIn_V_V]
connect_bd_intf_net [get_bd_intf_pins SFAST_process_data_0/xStreamOut_V_V] [get_bd_intf_pins eventStreamSwitch_0/xStreamIn0_V_V]
connect_bd_intf_net [get_bd_intf_pins SFAST_process_data_0/yStreamOut_V_V] [get_bd_intf_pins eventStreamSwitch_0/yStreamIn0_V_V]
connect_bd_intf_net [get_bd_intf_pins SFAST_process_data_0/tsStreamOut_V_V] [get_bd_intf_pins eventStreamSwitch_0/tsStreamIn0_V_V]
connect_bd_intf_net [get_bd_intf_pins SFAST_process_data_0/polStreamOut_V_V] [get_bd_intf_pins eventStreamSwitch_0/polStreamIn0_V_V]
connect_bd_intf_net [get_bd_intf_pins SFAST_process_data_0/isFinalCornerStream_V_V] [get_bd_intf_pins eventStreamSwitch_0/cornerStreamIn0_V_V]
connect_bd_intf_net [get_bd_intf_pins ps7_0_axi_periph/M05_AXI] [get_bd_intf_pins eventStreamSwitch_0/s_axi_config]
connect_bd_intf_net [get_bd_intf_ports DDR] [get_bd_intf_pins processing_system7_0/DDR]
connect_bd_intf_net [get_bd_intf_ports FIXED_IO] [get_bd_intf_pins processing_system7_0/FIXED_IO]
connect_bd_net -net DVSAERData_AI_0_1 [get_bd_ports DVSAERData_AI_0] [get_bd_pins testAERDVSSM_0/DVSAERData_AI] [get_bd_pins system_ila_0/probe1]
connect_bd_net -net DVSAERReq_ABI_0_1 [get_bd_ports DVSAERReq_ABI_0] [get_bd_pins testAERDVSSM_0/DVSAERReq_ABI] [get_bd_pins system_ila_0/probe2]
connect_bd_net -net IMUInterrupt_AI_0_1 [get_bd_ports IMUInterrupt_AI_0] [get_bd_pins testAERDVSSM_0/IMUInterrupt_AI]
connect_bd_net [get_bd_pins LEDShifter_0/led] [get_bd_ports led_0]
connect_bd_net [get_bd_ports IMUData_DZIO_0] [get_bd_pins testAERDVSSM_0/IMUData_DZIO]
connect_bd_net [get_bd_pins const_HIGH/dout] [get_bd_pins v_axi4s_vid_out_0/aclken] [get_bd_pins v_axi4s_vid_out_0/vid_io_out_ce]
connect_bd_net -net SyncInClock_AI_0_1 [get_bd_ports SyncInClock_AI_0] [get_bd_pins testAERDVSSM_0/SyncInClock_AI]
connect_bd_net -net SyncInSignal1_AI_0_1 [get_bd_ports SyncInSignal1_AI_0] [get_bd_pins testAERDVSSM_0/SyncInSignal1_AI]
connect_bd_net -net SyncInSignal2_AI_0_1 [get_bd_ports SyncInSignal2_AI_0] [get_bd_pins testAERDVSSM_0/SyncInSignal2_AI]
connect_bd_net -net SyncInSignal_AI_0_1 [get_bd_ports SyncInSignal_AI_0] [get_bd_pins testAERDVSSM_0/SyncInSignal_AI]
connect_bd_net [get_bd_pins axi_gpio_0/gpio_io_o] \
  [get_bd_pins xlslice_0/Din] [get_bd_pins xlslice_1/Din] [get_bd_pins xlslice_2/Din] [get_bd_pins xlslice_3/Din] \
  [get_bd_pins xlslice_4/Din]
connect_bd_net [get_bd_pins const_VCC/dout] \
  [get_bd_pins eventStreamToConstEn_0/ap_start] [get_bd_pins processing_system7_0/SPI0_SS_I] \
  [get_bd_pins RawStreamToFIFO_0/ap_start] [get_bd_pins eventSimulator_0/ap_start] \
  [get_bd_pins eventsGeneratorViaFi_0/ap_start] [get_bd_pins EVMUXDataToXYTSStream_0/ap_start] \
  [get_bd_pins XYTSStreamToRawStream_0/ap_start] [get_bd_pins eventStreamSwitch_0/ap_start] \
  [get_bd_pins SFAST_process_data_0/ap_start] [get_bd_pins EVABMOFStreamWithCon_0/ap_start]
connect_bd_net [get_bd_pins proc_sys_reset_0/peripheral_aresetn] \
  [get_bd_pins axi_gpio_0/s_axi_aresetn] [get_bd_pins axi_smc/aresetn] [get_bd_pins axi_vdma_0/axi_resetn] \
  [get_bd_pins eventStreamToConstEn_0/ap_rst_n] [get_bd_pins axis_data_fifo_0/s_axis_aresetn] \
  [get_bd_pins dataSwitch_0/rst_n_i] [get_bd_pins RawStreamToFIFO_0/ap_rst_n] [get_bd_pins eventSimulator_0/ap_rst_n] \
  [get_bd_pins eventsGeneratorViaFi_0/ap_rst_n] [get_bd_pins EVMUXDataToXYTSStream_0/ap_rst_n] \
  [get_bd_pins XYTSStreamToRawStream_0/ap_rst_n] [get_bd_pins eventStreamSwitch_0/ap_rst_n] \
  [get_bd_pins SFAST_process_data_0/ap_rst_n] [get_bd_pins ps7_0_axi_periph/S00_ARESETN] \
  [get_bd_pins ps7_0_axi_periph/M00_ARESETN] [get_bd_pins ps7_0_axi_periph/M01_ARESETN] \
  [get_bd_pins ps7_0_axi_periph/M02_ARESETN] [get_bd_pins ps7_0_axi_periph/M03_ARESETN] \
  [get_bd_pins ps7_0_axi_periph/M04_ARESETN] [get_bd_pins ps7_0_axi_periph/M05_ARESETN] \
  [get_bd_pins EVABMOFStreamWithCon_0/ap_rst_n]
connect_bd_net [get_bd_pins proc_sys_reset_1/peripheral_aresetn] [get_bd_pins v_axi4s_vid_out_0/aresetn] [get_bd_pins v_tc_0/resetn]
connect_bd_net [get_bd_pins processing_system7_0/FCLK_CLK0] \
  [get_bd_pins axi_gpio_0/s_axi_aclk] [get_bd_pins axi_smc/aclk] [get_bd_pins axi_vdma_0/s_axi_lite_aclk] \
  [get_bd_pins axi_vdma_0/m_axi_mm2s_aclk] [get_bd_pins axi_vdma_0/m_axis_mm2s_aclk] [get_bd_pins axi_vdma_0/m_axi_s2mm_aclk] \
  [get_bd_pins axi_vdma_0/s_axis_s2mm_aclk] [get_bd_pins eventStreamToConstEn_0/ap_clk] \
  [get_bd_pins proc_sys_reset_0/slowest_sync_clk] [get_bd_pins processing_system7_0/M_AXI_GP0_ACLK] \
  [get_bd_pins processing_system7_0/S_AXI_HP0_ACLK] [get_bd_pins system_ila_0/clk] [get_bd_pins v_axi4s_vid_out_0/aclk] \
  [get_bd_pins fifo_generator_0/wr_clk] [get_bd_pins axis_data_fifo_0/s_axis_aclk] [get_bd_pins fifo_generator_4/clk] \
  [get_bd_pins fifo_generator_3/clk] [get_bd_pins fifo_generator_2/clk] [get_bd_pins c_addsub_0/CLK] \
  [get_bd_pins fifo_generator_1/clk] [get_bd_pins dataSwitch_0/clk_i] [get_bd_pins testAERDVSSM_0/USBClock_CI] \
  [get_bd_pins testAERDVSSM_0/LogicClk_CI] [get_bd_pins testAERDVSSM_0/ADCClk_CI] [get_bd_pins RawStreamToFIFO_0/ap_clk] \
  [get_bd_pins eventSimulator_0/ap_clk] [get_bd_pins eventsGeneratorViaFi_0/ap_clk] \
  [get_bd_pins EVMUXDataToXYTSStream_0/ap_clk] [get_bd_pins XYTSStreamToRawStream_0/ap_clk] \
  [get_bd_pins eventStreamSwitch_0/ap_clk] [get_bd_pins SFAST_process_data_0/ap_clk] [get_bd_pins ps7_0_axi_periph/ACLK] \
  [get_bd_pins ps7_0_axi_periph/S00_ACLK] [get_bd_pins ps7_0_axi_periph/M00_ACLK] [get_bd_pins ps7_0_axi_periph/M01_ACLK] \
  [get_bd_pins ps7_0_axi_periph/M02_ACLK] [get_bd_pins ps7_0_axi_periph/M03_ACLK] [get_bd_pins ps7_0_axi_periph/M04_ACLK] \
  [get_bd_pins ps7_0_axi_periph/M05_ACLK] [get_bd_pins EVABMOFStreamWithCon_0/ap_clk]
connect_bd_net [get_bd_pins processing_system7_0/FCLK_CLK1] \
  [get_bd_pins LEDShifter_0/clk] [get_bd_pins proc_sys_reset_1/slowest_sync_clk] \
  [get_bd_pins v_axi4s_vid_out_0/vid_io_out_clk] [get_bd_pins v_tc_0/clk]
connect_bd_net [get_bd_pins processing_system7_0/FCLK_RESET0_N] \
  [get_bd_pins proc_sys_reset_0/ext_reset_in] [get_bd_pins proc_sys_reset_1/ext_reset_in]
connect_bd_net [get_bd_pins testAERDVSSM_0/ChipBiasAddrSelect_SBO] [get_bd_ports ChipBiasAddrSelect_SBO_0]
connect_bd_net [get_bd_pins testAERDVSSM_0/ChipBiasBitIn_DO] [get_bd_ports ChipBiasBitIn_DO_0]
connect_bd_net [get_bd_pins testAERDVSSM_0/ChipBiasClock_CBO] [get_bd_ports ChipBiasClock_CBO_0]
connect_bd_net [get_bd_pins testAERDVSSM_0/ChipBiasDiagSelect_SO] [get_bd_ports ChipBiasDiagSelect_SO_0]
connect_bd_net [get_bd_pins testAERDVSSM_0/ChipBiasEnable_SO] [get_bd_ports ChipBiasEnable_SO_0]
connect_bd_net [get_bd_pins testAERDVSSM_0/ChipBiasLatch_SBO] [get_bd_ports ChipBiasLatch_SBO_0]
connect_bd_net [get_bd_pins testAERDVSSM_0/DVSAERAck_SBO] [get_bd_ports DVSAERAck_SBO_0] [get_bd_pins system_ila_0/probe3]
connect_bd_net [get_bd_pins testAERDVSSM_0/DVSAERReset_SBO] [get_bd_ports DVSAERReset_SBO_0]
connect_bd_net [get_bd_pins testAERDVSSM_0/IMUClock_CZO] [get_bd_ports IMUClock_CZO_0]
connect_bd_net [get_bd_pins testAERDVSSM_0/IMUFSync_SO] [get_bd_ports IMUFSync_SO_0]
connect_bd_net [get_bd_pins testAERDVSSM_0/SyncOutClock_CO] [get_bd_ports SyncOutClock_CO_0]
connect_bd_net [get_bd_pins testAERDVSSM_0/SyncOutSignal_SO] [get_bd_ports SyncOutSignal_SO_0]
connect_bd_net [get_bd_pins v_axi4s_vid_out_0/vid_data] [get_bd_ports vid_data]
connect_bd_net [get_bd_pins v_axi4s_vid_out_0/vid_hsync] [get_bd_ports vid_hsync]
connect_bd_net [get_bd_pins v_axi4s_vid_out_0/vid_vsync] [get_bd_ports vid_vsync]
connect_bd_net [get_bd_pins v_axi4s_vid_out_0/vtg_ce] [get_bd_pins v_tc_0/gen_clken]
connect_bd_net [get_bd_pins const_ZERO/dout] [get_bd_pins v_axi4s_vid_out_0/fid] [get_bd_pins v_axi4s_vid_out_0/vid_io_out_reset]
connect_bd_net [get_bd_pins axi_gpio_0/ip2intc_irpt] [get_bd_pins xlconcat_0/In1]
connect_bd_net [get_bd_pins xlconcat_0/dout] [get_bd_pins processing_system7_0/IRQ_F2P]
connect_bd_net -net xlconstant_1_dout [get_bd_pins cons_HIGH/dout] \
  [get_bd_pins LEDShifter_0/rstn] [get_bd_pins util_vector_logic_0/Op1] [get_bd_pins SPI_Master_With_Sing_0/i_Rst_L] \
  [get_bd_pins usb_cdc_core_0/enable_i] [get_bd_pins usb_cdc_core_0/outport_accept_i] [get_bd_pins system_ila_0/probe0]
connect_bd_net [get_bd_pins util_vector_logic_0/Res] [get_bd_pins USBFifoToDVSSPI_0/rst_i] [get_bd_pins testAERDVSSM_0/Reset_RI]
connect_bd_net [get_bd_pins SPI_Master_With_Sing_0/o_RX_DV] [get_bd_pins system_ila_2/probe21] [get_bd_pins USBFifoToDVSSPI_0/dvsRXDataValid_i]
connect_bd_net [get_bd_pins SPI_Master_With_Sing_0/o_RX_Byte] [get_bd_pins system_ila_2/probe10] [get_bd_pins USBFifoToDVSSPI_0/dvsRXByte_i]
connect_bd_net -net c_counter_binary_0_Q [get_bd_pins usb_cdc_core_0/axi_bram_addr_o] \
  [get_bd_pins system_ila_2/probe11] [get_bd_pins USBFifoToDVSSPI_0/dvs_resp_addr_i]
connect_bd_net [get_bd_pins SPI_Master_With_Sing_0/o_TX_Ready] [get_bd_pins system_ila_2/probe5] [get_bd_pins USBFifoToDVSSPI_0/spiReady_i]
connect_bd_net [get_bd_pins USBFifoToDVSSPI_0/outputData_o] [get_bd_pins system_ila_2/probe6] [get_bd_pins SPI_Master_With_Sing_0/i_TX_Byte]
connect_bd_net [get_bd_pins USBFifoToDVSSPI_0/outputDataValid_o] [get_bd_pins system_ila_2/probe7] [get_bd_pins SPI_Master_With_Sing_0/i_TX_DV]
connect_bd_net -net o_RX_Count [get_bd_pins SPI_Master_With_Sing_0/o_RX_Count] [get_bd_pins system_ila_2/probe0]
connect_bd_net -net rxDataComplete_o [get_bd_pins USBFifoToDVSSPI_0/rxDataComplete_o] \
  [get_bd_pins system_ila_2/probe3] [get_bd_pins usb_cdc_core_0/ctrl_host_ack_i]
connect_bd_net -net dvs_resp_data_o [get_bd_pins USBFifoToDVSSPI_0/dvs_resp_data_o] \
  [get_bd_pins system_ila_2/probe4] [get_bd_pins usb_cdc_core_0/axi_bram_r_data_i]
connect_bd_net [get_bd_pins xlconstant_0/dout] [get_bd_pins SPI_Master_With_Sing_0/i_TX_Count]
connect_bd_net -net ulpi_dir_i_0_1 [get_bd_ports ulpi_dir_i_0] [get_bd_pins system_ila_2/probe16] [get_bd_pins ulpi_wrapper_0/ulpi_dir_i]
connect_bd_net -net ulpi_nxt_i_0_1 [get_bd_ports ulpi_nxt_i_0] [get_bd_pins system_ila_2/probe17] [get_bd_pins ulpi_wrapper_0/ulpi_nxt_i]
connect_bd_net [get_bd_ports ulpi_data_io_0] [get_bd_pins ulpi_wrapper_0/ulpi_data_io]
connect_bd_net [get_bd_pins xlslice_0/Dout] [get_bd_pins usb_cdc_core_0/rst_i]
connect_bd_net [get_bd_pins xlslice_1/Dout] [get_bd_pins ulpi_wrapper_0/ulpi_rst_i]
connect_bd_net [get_bd_pins ulpi_wrapper_0/ulpi_stp_o] [get_bd_ports ulpi_stp_o_0] [get_bd_pins system_ila_2/probe18]
connect_bd_net [get_bd_pins ulpi_wrapper_0/utmi_data_in_o] [get_bd_pins usb_cdc_core_0/utmi_data_in_i] [get_bd_pins system_ila_2/probe61]
connect_bd_net [get_bd_pins ulpi_wrapper_0/utmi_txready_o] \
  [get_bd_pins usb_cdc_core_0/utmi_txready_i] [get_bd_pins system_ila_2/probe53] [get_bd_pins system_ila_0/probe11]
connect_bd_net [get_bd_pins ulpi_wrapper_0/utmi_rxvalid_o] [get_bd_pins usb_cdc_core_0/utmi_rxvalid_i] [get_bd_pins system_ila_2/probe45]
connect_bd_net [get_bd_pins ulpi_wrapper_0/utmi_rxactive_o] [get_bd_pins usb_cdc_core_0/utmi_rxactive_i] [get_bd_pins system_ila_2/probe46]
connect_bd_net [get_bd_pins ulpi_wrapper_0/utmi_rxerror_o] [get_bd_pins usb_cdc_core_0/utmi_rxerror_i]
connect_bd_net [get_bd_pins ulpi_wrapper_0/utmi_linestate_o] [get_bd_pins usb_cdc_core_0/utmi_linestate_i]
connect_bd_net [get_bd_pins usb_cdc_core_0/utmi_txvalid_o] [get_bd_pins ulpi_wrapper_0/utmi_txvalid_i]
connect_bd_net [get_bd_pins usb_cdc_core_0/utmi_op_mode_o] [get_bd_pins ulpi_wrapper_0/utmi_op_mode_i]
connect_bd_net [get_bd_pins usb_cdc_core_0/utmi_xcvrselect_o] [get_bd_pins ulpi_wrapper_0/utmi_xcvrselect_i]
connect_bd_net [get_bd_pins usb_cdc_core_0/utmi_data_out_o] [get_bd_pins ulpi_wrapper_0/utmi_data_out_i]
connect_bd_net [get_bd_pins usb_cdc_core_0/utmi_termselect_o] [get_bd_pins ulpi_wrapper_0/utmi_termselect_i]
connect_bd_net [get_bd_pins usb_cdc_core_0/utmi_dppulldown_o] [get_bd_pins ulpi_wrapper_0/utmi_dppulldown_i]
connect_bd_net [get_bd_pins usb_cdc_core_0/utmi_dmpulldown_o] [get_bd_pins ulpi_wrapper_0/utmi_dmpulldown_i]
connect_bd_net [get_bd_pins usb_cdc_core_0/outport_data_o] [get_bd_pins system_ila_2/probe12] [get_bd_pins USBFifoToDVSSPI_0/inputData_i]
connect_bd_net [get_bd_pins usb_cdc_core_0/outport_valid_o] [get_bd_pins system_ila_2/probe13] [get_bd_pins USBFifoToDVSSPI_0/inputDataValid_i]
connect_bd_net [get_bd_pins usb_cdc_core_0/data_complete_o_do] [get_bd_pins system_ila_2/probe14] [get_bd_pins USBFifoToDVSSPI_0/dataRecEnd_i]
connect_bd_net [get_bd_pins usb_cdc_core_0/rx_out_do] [get_bd_pins system_ila_2/probe15] [get_bd_pins USBFifoToDVSSPI_0/outDataRecStart_i]
connect_bd_net -net token_valid_w_do [get_bd_pins usb_cdc_core_0/token_valid_w_do] [get_bd_pins system_ila_2/probe19]
connect_bd_net [get_bd_pins usb_cdc_core_0/ep0_rx_setup_w_do] [get_bd_pins system_ila_2/probe20] [get_bd_pins USBFifoToDVSSPI_0/setupDataRecStart_i]
connect_bd_net -net r_RX_Bit_Count_do [get_bd_pins SPI_Master_With_Sing_0/r_RX_Bit_Count_do] [get_bd_pins system_ila_2/probe22]
connect_bd_net -net w_Master_Ready_do [get_bd_pins SPI_Master_With_Sing_0/w_Master_Ready_do] [get_bd_pins system_ila_2/probe23]
connect_bd_net -net r_TX_Bit_Count_do [get_bd_pins SPI_Master_With_Sing_0/r_TX_Bit_Count_do] [get_bd_pins system_ila_2/probe24]
connect_bd_net -net setupPktReceived_q_do [get_bd_pins USBFifoToDVSSPI_0/setupPktReceived_q_do] [get_bd_pins system_ila_2/probe1]
connect_bd_net -net dataSPIToSendPrepared_w_do [get_bd_pins USBFifoToDVSSPI_0/dataSPIToSendPrepared_w_do] [get_bd_pins system_ila_2/probe2]
connect_bd_net -net outPktReceived_q_do [get_bd_pins USBFifoToDVSSPI_0/outPktReceived_q_do] [get_bd_pins system_ila_2/probe25]
connect_bd_net -net wrSetupIndex_q_do [get_bd_pins USBFifoToDVSSPI_0/wrSetupIndex_q_do] [get_bd_pins system_ila_2/probe27]
connect_bd_net -net wrOUTIndex_q_do [get_bd_pins USBFifoToDVSSPI_0/wrOUTIndex_q_do] [get_bd_pins system_ila_2/probe28]
connect_bd_net -net ctrl_sending_r_do [get_bd_pins usb_cdc_core_0/ctrl_sending_r_do] [get_bd_pins system_ila_2/probe26]
connect_bd_net -net setup_resp_valid_delay_q_do [get_bd_pins usb_cdc_core_0/setup_resp_valid_delay_q_do] [get_bd_pins system_ila_2/probe29]
connect_bd_net -net setup_valid_q_do [get_bd_pins usb_cdc_core_0/setup_valid_q_do] [get_bd_pins system_ila_2/probe30]
connect_bd_net -net ctrl_txdata_q_do [get_bd_pins usb_cdc_core_0/ctrl_txdata_q_do] [get_bd_pins system_ila_2/probe31]
connect_bd_net -net ctrl_txvalid_q_do [get_bd_pins usb_cdc_core_0/ctrl_txvalid_q_do] [get_bd_pins system_ila_2/probe32]
connect_bd_net -net ulpi_data_out_i_d [get_bd_pins ulpi_wrapper_0/ulpi_data_out_i_d] [get_bd_pins system_ila_2/probe33]
connect_bd_net -net ulpi_data_in_o_d [get_bd_pins ulpi_wrapper_0/ulpi_data_in_o_d] [get_bd_pins system_ila_2/probe34]
connect_bd_net [get_bd_pins proc_sys_reset_0/interconnect_aresetn] [get_bd_pins ps7_0_axi_periph/ARESETN]
connect_bd_net -net ctrl_stall_r_do [get_bd_pins usb_cdc_core_0/ctrl_stall_r_do] [get_bd_pins system_ila_2/probe35]
connect_bd_net -net ctrl_ack_r_do [get_bd_pins usb_cdc_core_0/ctrl_ack_r_do] [get_bd_pins system_ila_2/probe36]
connect_bd_net -net bmRequestType_w_do [get_bd_pins usb_cdc_core_0/bmRequestType_w_do] [get_bd_pins system_ila_2/probe37]
connect_bd_net -net readAXIBRAM_r_do [get_bd_pins usb_cdc_core_0/readAXIBRAM_r_do] [get_bd_pins system_ila_2/probe38]
connect_bd_net -net status_stage_w_do [get_bd_pins usb_cdc_core_0/status_stage_w_do] [get_bd_pins system_ila_2/probe39]
connect_bd_net -net usbf_tx_pid_q_do [get_bd_pins usb_cdc_core_0/usbf_tx_pid_q_do] [get_bd_pins system_ila_2/probe40]
connect_bd_net -net usbf_ep_data_bit_r_do [get_bd_pins usb_cdc_core_0/usbf_ep_data_bit_r_do] [get_bd_pins system_ila_2/probe41]
connect_bd_net -net usbf_tx_valid_q_do [get_bd_pins usb_cdc_core_0/usbf_tx_valid_q_do] [get_bd_pins system_ila_2/probe42]
connect_bd_net -net usbf_state_q_do [get_bd_pins usb_cdc_core_0/usbf_state_q_do] [get_bd_pins system_ila_2/probe43]
connect_bd_net -net usbf_new_data_bit_r_do [get_bd_pins usb_cdc_core_0/usbf_new_data_bit_r_do] [get_bd_pins system_ila_2/probe44]
connect_bd_net -net state_o [get_bd_pins ulpi_wrapper_0/state_o] [get_bd_pins system_ila_2/probe47]
connect_bd_net -net usb_reset_w_do [get_bd_pins usb_cdc_core_0/usb_reset_w_do] [get_bd_pins system_ila_2/probe48]
connect_bd_net [get_bd_pins testAERDVSSM_0/SPIMISO_DZO] [get_bd_pins SPI_Master_With_Sing_0/i_SPI_MISO]
connect_bd_net [get_bd_pins SPI_Master_With_Sing_0/o_SPI_Clk] [get_bd_pins testAERDVSSM_0/SPIClock_AI]
connect_bd_net [get_bd_pins SPI_Master_With_Sing_0/o_SPI_MOSI] [get_bd_pins testAERDVSSM_0/SPIMOSI_AI]
connect_bd_net [get_bd_pins SPI_Master_With_Sing_0/o_SPI_CS_n] [get_bd_pins testAERDVSSM_0/SPISlaveSelect_ABI]
connect_bd_net [get_bd_pins testAERDVSSM_0/AERSMOutFifoWrite_SO] \
  [get_bd_pins system_ila_2/probe50] [get_bd_pins system_ila_0/probe7] \
  [get_bd_pins EVMUXDataToXYTSStream_0/eventFIFODataValid_V]
connect_bd_net [get_bd_pins fifo_generator_0/dout] \
  [get_bd_pins system_ila_2/probe8] [get_bd_pins usb_cdc_core_0/inport_data_i] [get_bd_pins system_ila_0/probe5]
connect_bd_net [get_bd_pins fifo_generator_0/empty] \
  [get_bd_pins system_ila_2/probe9] [get_bd_pins c_addsub_as_invert_and_delay1/A] [get_bd_pins usb_cdc_core_0/inport_valid_i]
connect_bd_net -net wr_data_count [get_bd_pins fifo_generator_0/wr_data_count] [get_bd_pins xlslice_5/Din] [get_bd_pins system_ila_0/probe6]
connect_bd_net -net rd_data_count [get_bd_pins fifo_generator_0/rd_data_count] [get_bd_pins system_ila_2/probe49]
connect_bd_net [get_bd_pins xlslice_5/Dout] [get_bd_pins util_vector_logic_2/Op1]
connect_bd_net [get_bd_pins xlconstant_ONE/dout] [get_bd_pins util_vector_logic_2/Op2]
connect_bd_net [get_bd_pins util_vector_logic_2/Res] [get_bd_pins util_vector_logic_3/Op1]
connect_bd_net [get_bd_pins usb_cdc_core_0/inport_accept_o] \
  [get_bd_pins util_vector_logic_3/Op2] [get_bd_pins fifo_generator_0/rd_en] [get_bd_pins system_ila_2/probe51] \
  [get_bd_pins system_ila_0/probe4]
connect_bd_net -net sie_tx_state_q_o [get_bd_pins usb_cdc_core_0/sie_tx_state_q_o] [get_bd_pins system_ila_2/probe52]
connect_bd_net -net ep2_tx_data_valid_w_do [get_bd_pins usb_cdc_core_0/ep2_tx_data_valid_w_do] [get_bd_pins system_ila_2/probe55]
connect_bd_net -net ep2_tx_data_w_do [get_bd_pins usb_cdc_core_0/ep2_tx_data_w_do] [get_bd_pins system_ila_2/probe56]
connect_bd_net [get_bd_pins testAERDVSSM_0/AERSMOutFifoData_DO] \
  [get_bd_pins system_ila_2/probe75] [get_bd_pins system_ila_0/probe18] [get_bd_pins EVMUXDataToXYTSStream_0/eventFIFOIn_V]
connect_bd_net -net state_r_do [get_bd_pins usb_cdc_core_0/state_r_do] [get_bd_pins system_ila_2/probe57]
connect_bd_net -net usb_rst_time_do [get_bd_pins usb_cdc_core_0/usb_rst_time_do] [get_bd_pins system_ila_2/probe58]
connect_bd_net -net usb_reset_counter_q_do [get_bd_pins usb_cdc_core_0/usb_reset_counter_q_do] [get_bd_pins system_ila_2/probe59]
connect_bd_net -net tx_sent_data_counter_o [get_bd_pins usb_cdc_core_0/tx_sent_data_counter_o] [get_bd_pins system_ila_2/probe60]
connect_bd_net -net ulpi_nxt_q_do [get_bd_pins ulpi_wrapper_0/ulpi_nxt_q_do] [get_bd_pins system_ila_2/probe63]
connect_bd_net -net ulpi_dir_q_do [get_bd_pins ulpi_wrapper_0/ulpi_dir_q_do] [get_bd_pins system_ila_2/probe64]
connect_bd_net -net utmi_data_q_do [get_bd_pins ulpi_wrapper_0/utmi_data_q_do] [get_bd_pins system_ila_2/probe62]
connect_bd_net -net ep0_rx_valid_w_do [get_bd_pins usb_cdc_core_0/ep0_rx_valid_w_do] [get_bd_pins system_ila_2/probe65]
connect_bd_net -net setup_wr_idx_q_do [get_bd_pins usb_cdc_core_0/setup_wr_idx_q_do] [get_bd_pins system_ila_2/probe66]
connect_bd_net -net rx_strb_w_do [get_bd_pins usb_cdc_core_0/rx_strb_w_do] [get_bd_pins system_ila_2/probe67]
connect_bd_net -net usbfrx_data_w_do [get_bd_pins usb_cdc_core_0/usbfrx_data_w_do] [get_bd_pins system_ila_2/probe68]
connect_bd_net -net usbfrx_crc_byte_w_do [get_bd_pins usb_cdc_core_0/usbfrx_crc_byte_w_do] [get_bd_pins system_ila_2/probe69]
connect_bd_net -net usbfrx_data_ready_w_do [get_bd_pins usb_cdc_core_0/usbfrx_data_ready_w_do] [get_bd_pins system_ila_2/probe70]
connect_bd_net -net usbfrx_shift_en_w_do [get_bd_pins usb_cdc_core_0/usbfrx_shift_en_w_do] [get_bd_pins system_ila_2/probe71]
connect_bd_net -net usbfrx_rx_active_w_do [get_bd_pins usb_cdc_core_0/usbfrx_rx_active_w_do] [get_bd_pins system_ila_2/probe72]
connect_bd_net -net ulpi_clk60_i_0_1 [get_bd_ports ulpi_clk60_i_0] \
  [get_bd_pins ulpi_wrapper_0/ulpi_clk60_i] [get_bd_pins USBFifoToDVSSPI_0/clk_i] [get_bd_pins SPI_Master_With_Sing_0/i_Clk] \
  [get_bd_pins fifo_generator_0/rd_clk] [get_bd_pins c_addsub_as_invert_and_delay1/CLK] [get_bd_pins usb_cdc_core_0/clk_i] \
  [get_bd_pins system_ila_2/clk]
connect_bd_net -net ep2_tx_data_last_w_do [get_bd_pins usb_cdc_core_0/ep2_tx_data_last_w_do] [get_bd_pins system_ila_2/probe73]
connect_bd_net [get_bd_pins usb_cdc_core_0/inport_valid_q_do] [get_bd_pins system_ila_2/probe54]
connect_bd_net [get_bd_pins fifo_generator_0/almost_full] [get_bd_pins util_vector_logic_1/Op1] [get_bd_pins system_ila_0/probe9]
connect_bd_net -net StreamToFIFO_0_fifoDataOut_V_din [get_bd_pins RawStreamToFIFO_0/fifoIFOutData_V] [get_bd_pins fifo_generator_0/din]
connect_bd_net -net StreamToFIFO_0_fifoDataOut_V_write [get_bd_pins RawStreamToFIFO_0/fifoIFOutData_V_ap_vld] \
  [get_bd_pins fifo_generator_0/wr_en] [get_bd_pins system_ila_0/probe10]
connect_bd_net [get_bd_pins util_vector_logic_1/Res] [get_bd_pins RawStreamToFIFO_0/fifoIFInFull_n_V] [get_bd_pins system_ila_0/probe8]
connect_bd_net [get_bd_pins xlcons_data_0x5a5a/dout] \
  [get_bd_pins eventStreamToConstEn_0/custDataStream_V_V_TDATA] [get_bd_pins eventStreamToConstEn_0/tsStream_V_V_TDATA] \
  [get_bd_pins eventStreamToConstEn_0/polStream_V_V_TDATA] [get_bd_pins eventStreamToConstEn_0/yStream_V_V_TDATA] \
  [get_bd_pins eventStreamToConstEn_0/xStream_V_V_TDATA] [get_bd_pins EVABMOFStreamWithCon_0/config_V]
connect_bd_net [get_bd_pins xlcons_valid_high/dout] \
  [get_bd_pins eventStreamToConstEn_0/xStream_V_V_TVALID] [get_bd_pins eventStreamToConstEn_0/yStream_V_V_TVALID] \
  [get_bd_pins eventStreamToConstEn_0/polStream_V_V_TVALID] [get_bd_pins eventStreamToConstEn_0/tsStream_V_V_TVALID] \
  [get_bd_pins eventStreamToConstEn_0/custDataStream_V_V_TVALID] [get_bd_pins EVMUXDataToXYTSStream_0/xStreamOut_V_V_TREADY] \
  [get_bd_pins EVMUXDataToXYTSStream_0/yStreamOut_V_V_TREADY] [get_bd_pins EVMUXDataToXYTSStream_0/tsStreamOut_V_V_TREADY] \
  [get_bd_pins EVMUXDataToXYTSStream_0/polStreamOut_V_V_TREADY]
connect_bd_net -net axis_data_count [get_bd_pins axis_data_fifo_0/axis_data_count] [get_bd_pins system_ila_0/probe12]
connect_bd_net -net tsReg_V [get_bd_pins XYTSStreamToRawStream_0/tsReg_V] [get_bd_pins system_ila_0/probe13]
connect_bd_net -net nonMonTSDiffFlgReg_V [get_bd_pins XYTSStreamToRawStream_0/nonMonTSDiffFlgReg_V] [get_bd_pins system_ila_0/probe14]
connect_bd_net -net nonMonTSDiffFlgReg_V_ap_vld [get_bd_pins XYTSStreamToRawStream_0/nonMonTSDiffFlgReg_V_ap_vld] [get_bd_pins system_ila_0/probe15]
connect_bd_net -net nonMonTSDiffFlgReg_V_ap_vld_1 [get_bd_pins RawStreamToFIFO_0/nonMonTSDiffFlgReg_V_ap_vld] [get_bd_pins system_ila_0/probe16]
connect_bd_net -net nonMonTSDiffFlgReg_V_1 [get_bd_pins RawStreamToFIFO_0/nonMonTSDiffFlgReg_V] [get_bd_pins system_ila_0/probe17]
connect_bd_net -net fifo_generator_0_prog_full [get_bd_pins util_vector_logic_4/Res] \
  [get_bd_pins testAERDVSSM_0/AERSMFifoAlmostFull_AI] [get_bd_pins testAERDVSSM_0/AERSMFifoFull_AI] \
  [get_bd_pins system_ila_0/probe39]
connect_bd_net -net skipNumReg_V [get_bd_pins RawStreamToFIFO_0/skipNumReg_V] [get_bd_pins system_ila_0/probe19]
connect_bd_net -net data_o_vd2 [get_bd_pins dataSwitch_0/data_o_vd2] [get_bd_pins system_ila_0/probe20]
connect_bd_net -net data_o_vd1 [get_bd_pins dataSwitch_0/data_o_vd1] [get_bd_pins system_ila_0/probe21]
connect_bd_net -net data_o_1 [get_bd_pins dataSwitch_0/data_o_1] [get_bd_pins system_ila_0/probe22]
connect_bd_net -net data_o_2 [get_bd_pins dataSwitch_0/data_o_2] [get_bd_pins system_ila_0/probe23]
connect_bd_net -net data_o_num1 [get_bd_pins dataSwitch_0/data_o_num1] [get_bd_pins system_ila_0/probe24]
connect_bd_net -net data_o_num2 [get_bd_pins dataSwitch_0/data_o_num2] [get_bd_pins system_ila_0/probe25]
connect_bd_net [get_bd_pins EVMUXDataToXYTSStream_0/xStreamOut_V_V_TVALID] \
  [get_bd_pins fifo_generator_1/wr_en] [get_bd_pins dataSwitch_0/data_vd_i] [get_bd_pins system_ila_0/probe26]
connect_bd_net [get_bd_pins EVMUXDataToXYTSStream_0/xStreamOut_V_V_TDATA] \
  [get_bd_pins fifo_generator_1/din] [get_bd_pins dataSwitch_0/data_i] [get_bd_pins system_ila_0/probe27]
connect_bd_net [get_bd_pins EVMUXDataToXYTSStream_0/yStreamOut_V_V_TDATA] [get_bd_pins fifo_generator_2/din] [get_bd_pins system_ila_0/probe28]
connect_bd_net [get_bd_pins EVMUXDataToXYTSStream_0/yStreamOut_V_V_TVALID] [get_bd_pins fifo_generator_2/wr_en] [get_bd_pins system_ila_0/probe29]
connect_bd_net [get_bd_pins EVMUXDataToXYTSStream_0/tsStreamOut_V_V_TDATA] [get_bd_pins fifo_generator_3/din]
connect_bd_net [get_bd_pins EVMUXDataToXYTSStream_0/tsStreamOut_V_V_TVALID] [get_bd_pins fifo_generator_3/wr_en]
connect_bd_net [get_bd_pins EVMUXDataToXYTSStream_0/polStreamOut_V_V_TVALID] [get_bd_pins fifo_generator_4/wr_en]
connect_bd_net [get_bd_pins EVMUXDataToXYTSStream_0/polStreamOut_V_V_TDATA] [get_bd_pins fifo_generator_4/din]
connect_bd_net -net EVFastCornerStream_0_xStreamIn_V_V_TREADY [get_bd_pins SFAST_process_data_0/xStreamIn_V_V_TREADY] \
  [get_bd_pins fifo_generator_1/rd_en] [get_bd_pins fifo_generator_2/rd_en] [get_bd_pins fifo_generator_3/rd_en] \
  [get_bd_pins fifo_generator_4/rd_en] [get_bd_pins c_addsub_0/CE] [get_bd_pins system_ila_0/probe38]
connect_bd_net [get_bd_pins fifo_generator_1/dout] [get_bd_pins system_ila_0/probe30] [get_bd_pins SFAST_process_data_0/xStreamIn_V_V_TDATA]
connect_bd_net [get_bd_pins fifo_generator_1/empty] [get_bd_pins c_addsub_0/A] [get_bd_pins system_ila_0/probe31]
connect_bd_net [get_bd_pins c_addsub_0/S] \
  [get_bd_pins system_ila_0/probe32] [get_bd_pins SFAST_process_data_0/xStreamIn_V_V_TVALID] \
  [get_bd_pins SFAST_process_data_0/yStreamIn_V_V_TVALID] [get_bd_pins SFAST_process_data_0/tsStreamIn_V_V_TVALID] \
  [get_bd_pins SFAST_process_data_0/polStreamIn_V_V_TVALID]
connect_bd_net [get_bd_pins fifo_generator_2/dout] [get_bd_pins system_ila_0/probe33] [get_bd_pins SFAST_process_data_0/yStreamIn_V_V_TDATA]
connect_bd_net [get_bd_pins fifo_generator_3/dout] [get_bd_pins system_ila_0/probe34] [get_bd_pins SFAST_process_data_0/tsStreamIn_V_V_TDATA]
connect_bd_net [get_bd_pins fifo_generator_4/dout] [get_bd_pins system_ila_0/probe35] [get_bd_pins SFAST_process_data_0/polStreamIn_V_V_TDATA]
connect_bd_net [get_bd_pins fifo_generator_1/almost_full] [get_bd_pins dataSwitch_0/select_i] [get_bd_pins system_ila_0/probe36]
connect_bd_net -net data_count [get_bd_pins fifo_generator_1/data_count] [get_bd_pins system_ila_0/probe37]
connect_bd_net [get_bd_pins fifo_generator_1/prog_full] [get_bd_pins util_vector_logic_4/Op1] [get_bd_pins system_ila_0/probe40]
connect_bd_net [get_bd_pins fifo_generator_0/prog_full] [get_bd_pins util_vector_logic_4/Op2] [get_bd_pins system_ila_0/probe41]
connect_bd_net [get_bd_pins xlslice_4/Dout] [get_bd_pins system_ila_0/probe42] [get_bd_pins eventStreamSwitch_0/select_V]
connect_bd_net [get_bd_pins config_data_const/dout] [get_bd_pins SFAST_process_data_0/config_V]
